# EAGLE design sr_controller_v1_revC (EAGLE 6.3)
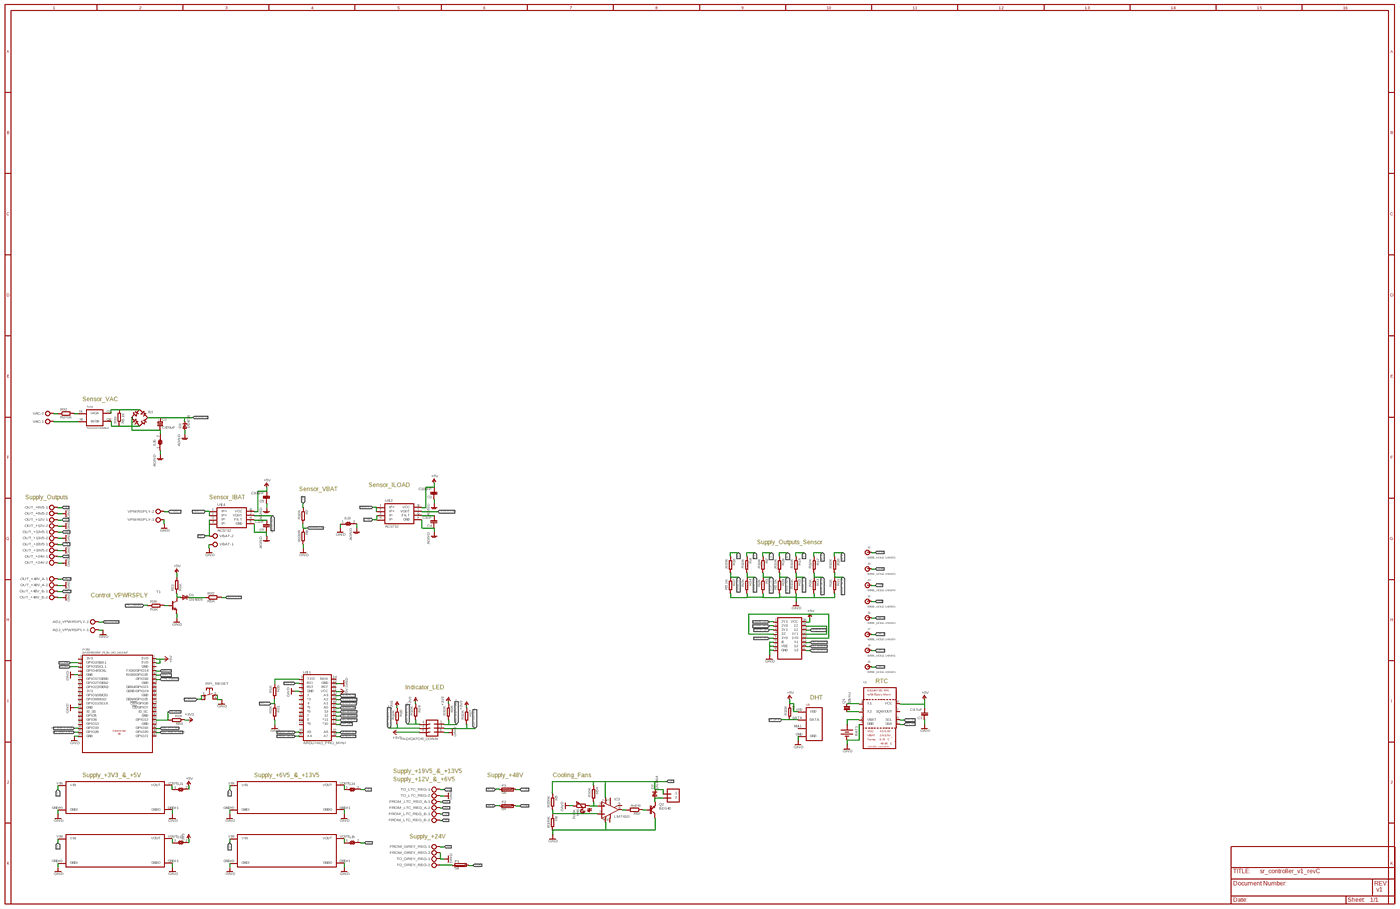
[diagram p0: schematic, sheet 1, overview]
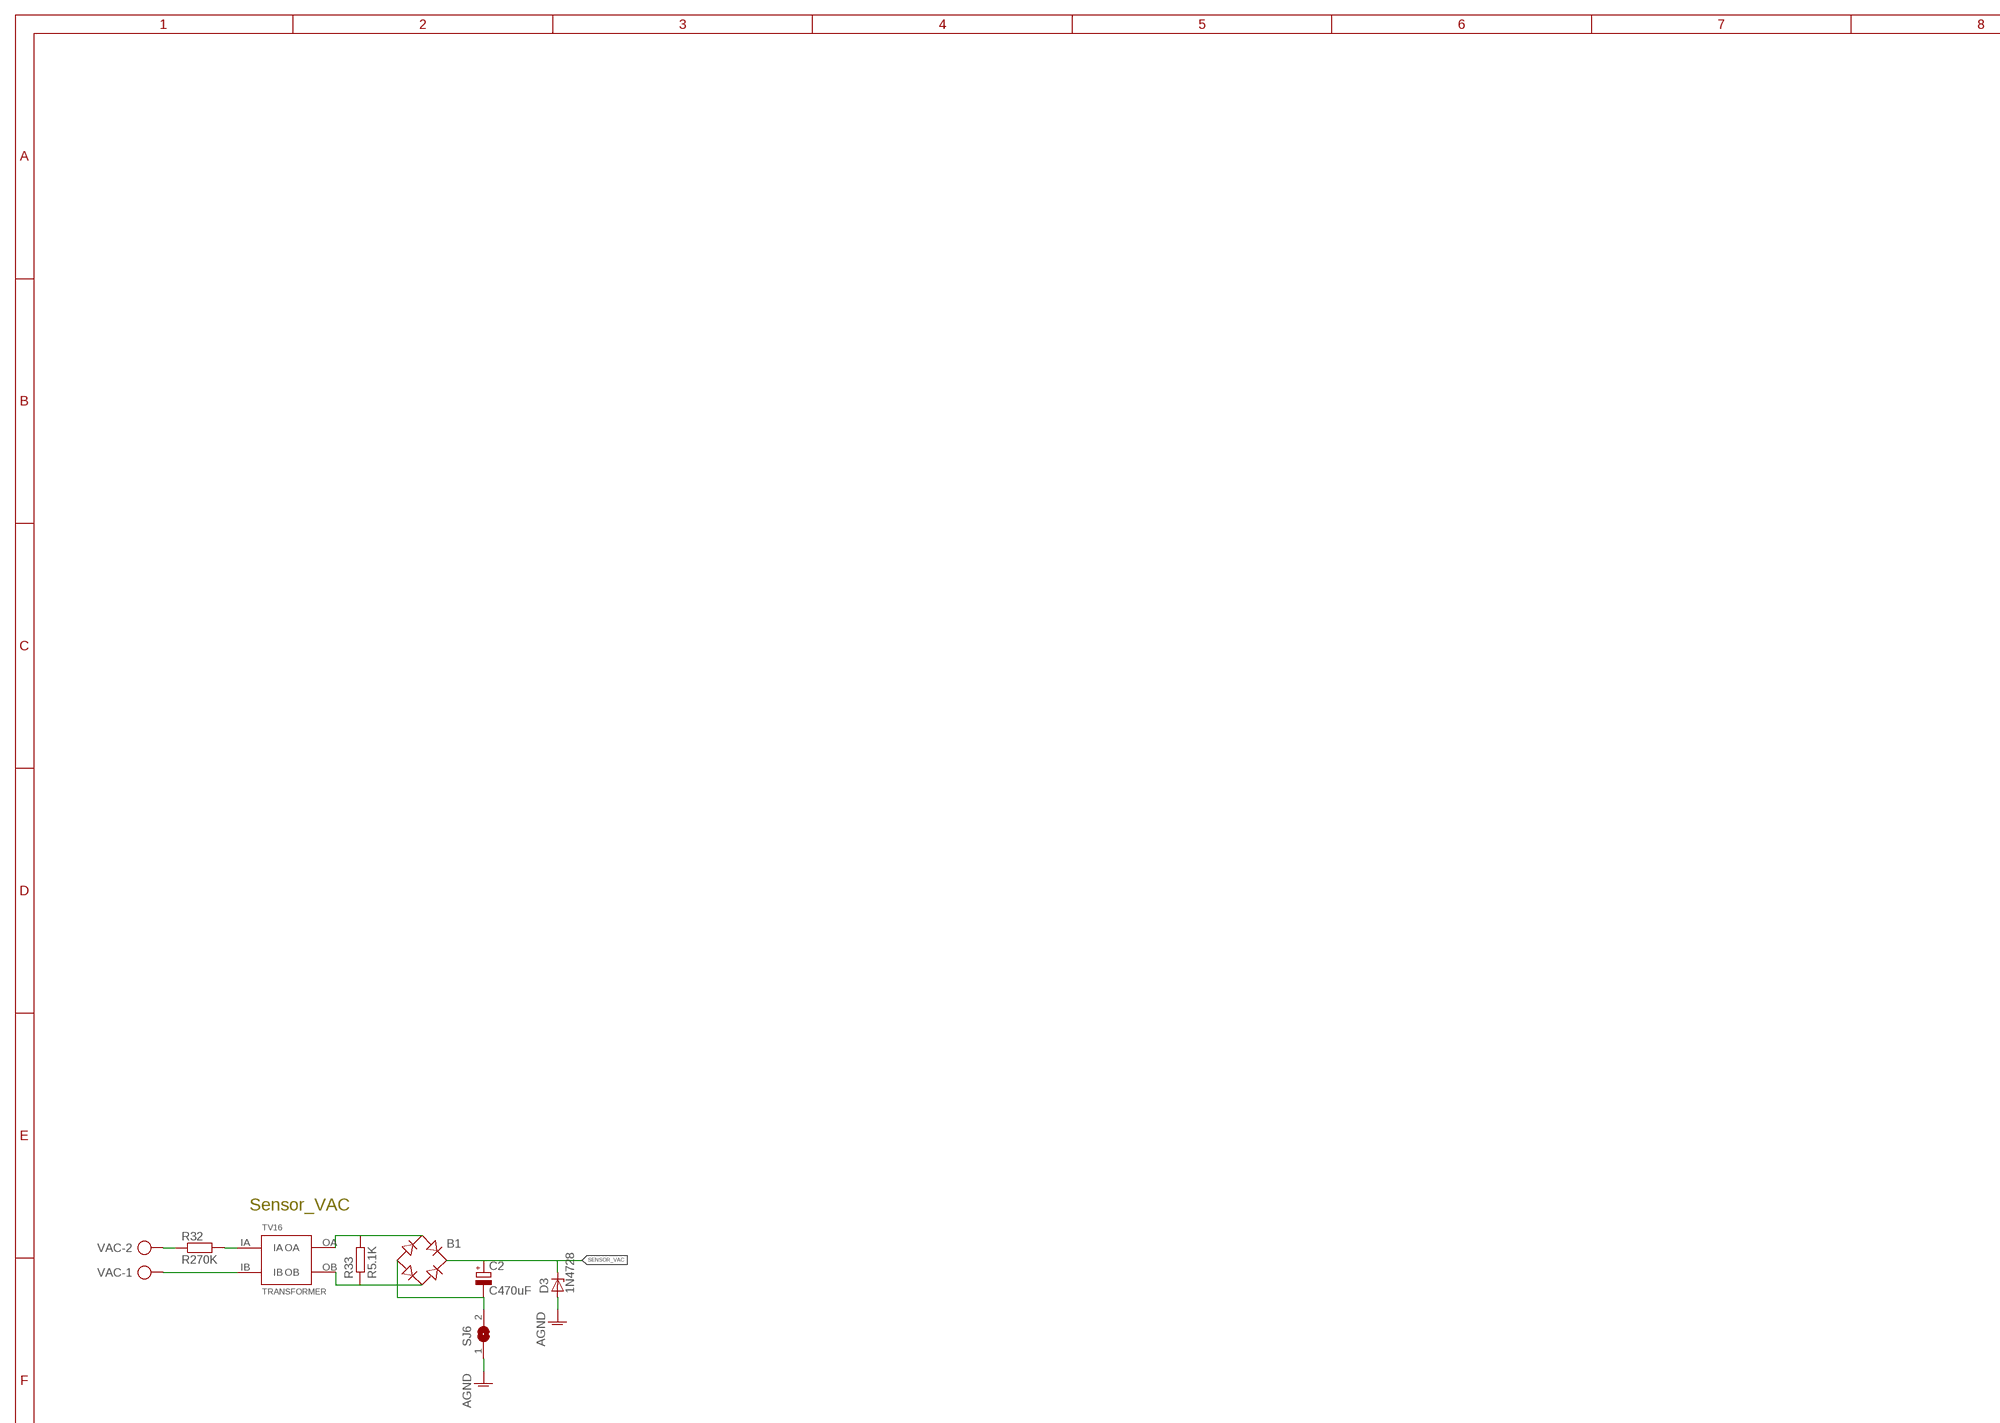
[diagram p1: schematic, sheet 1, part 1 of 4]
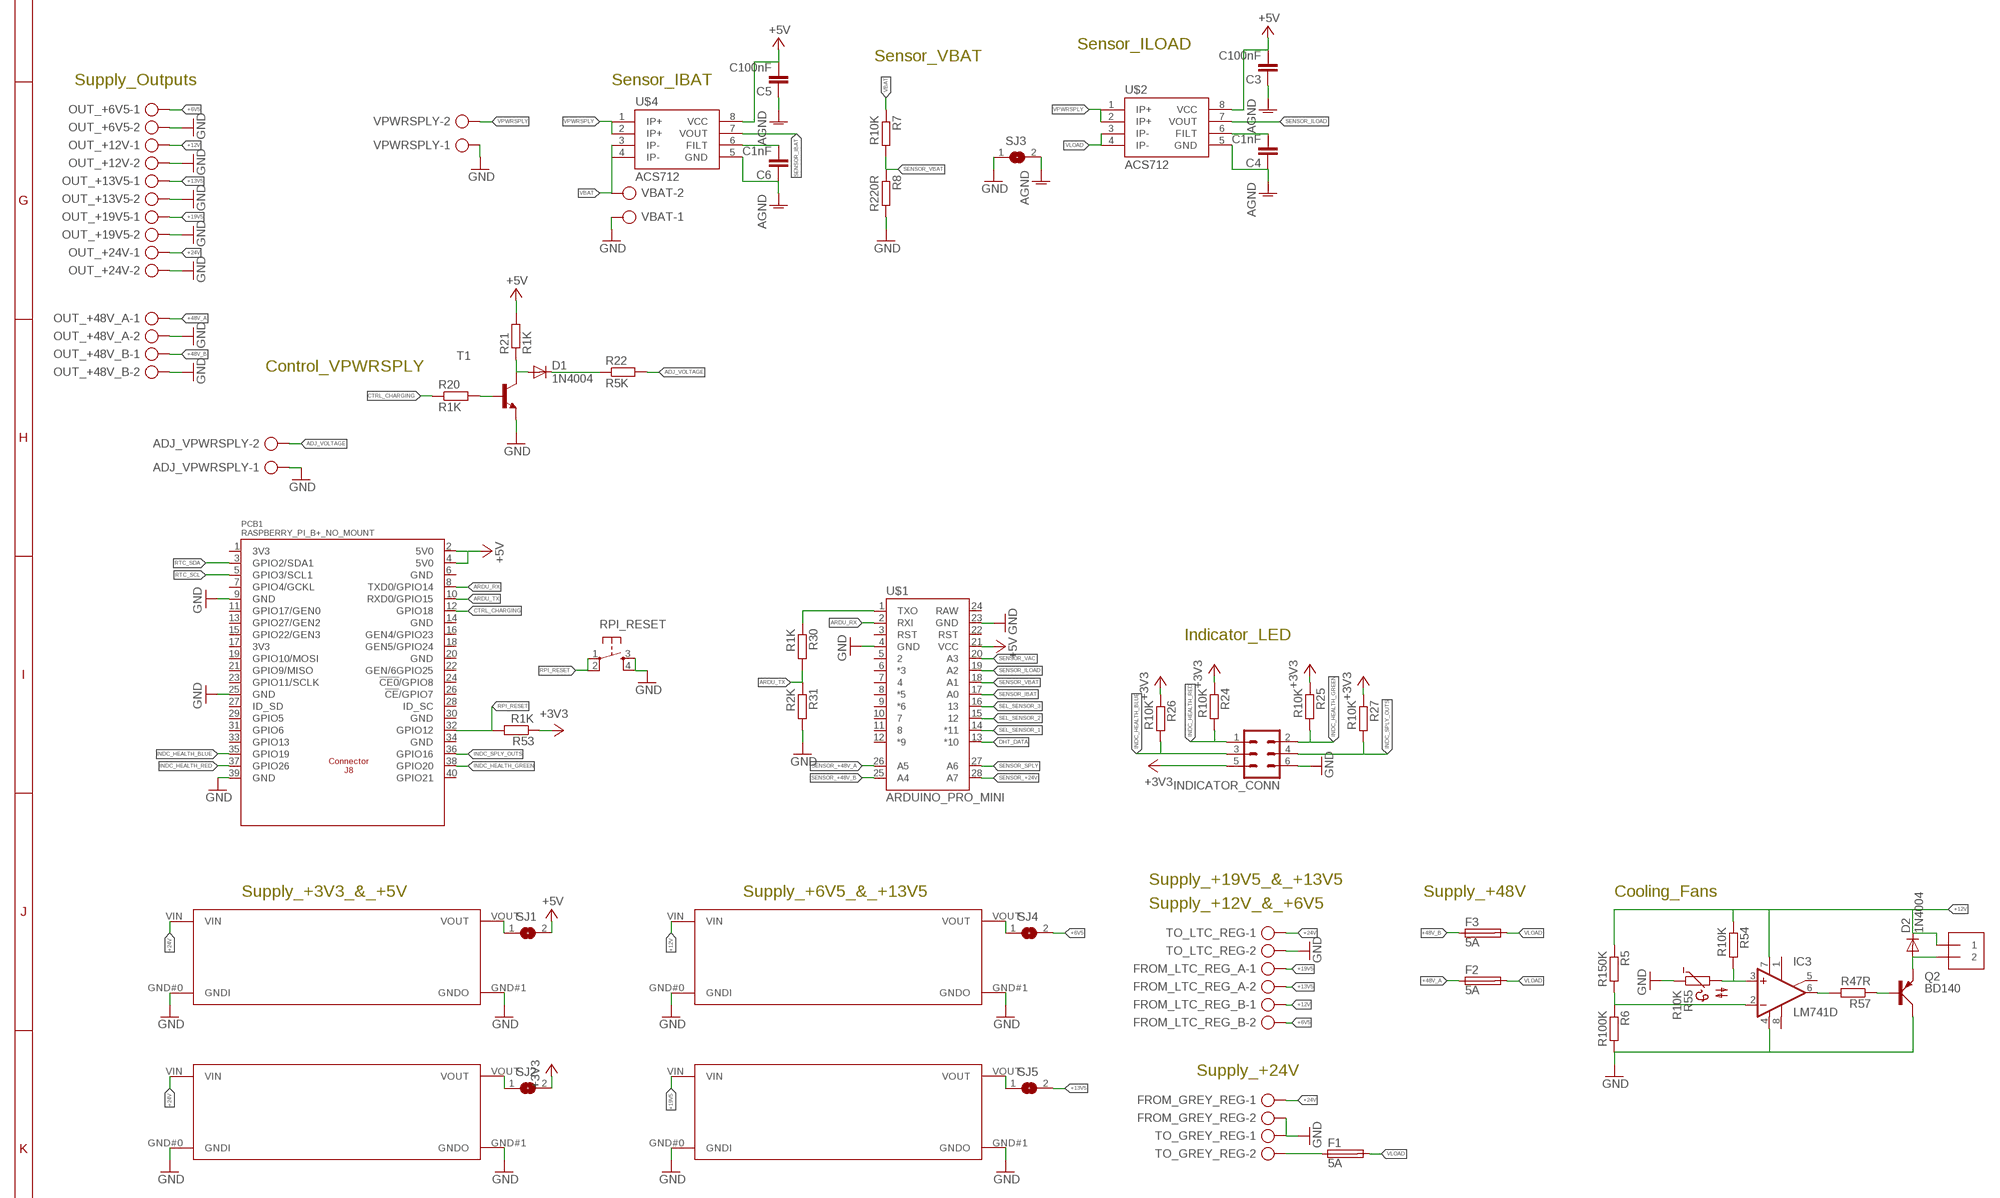
[diagram p2: schematic, sheet 1, part 2 of 4]
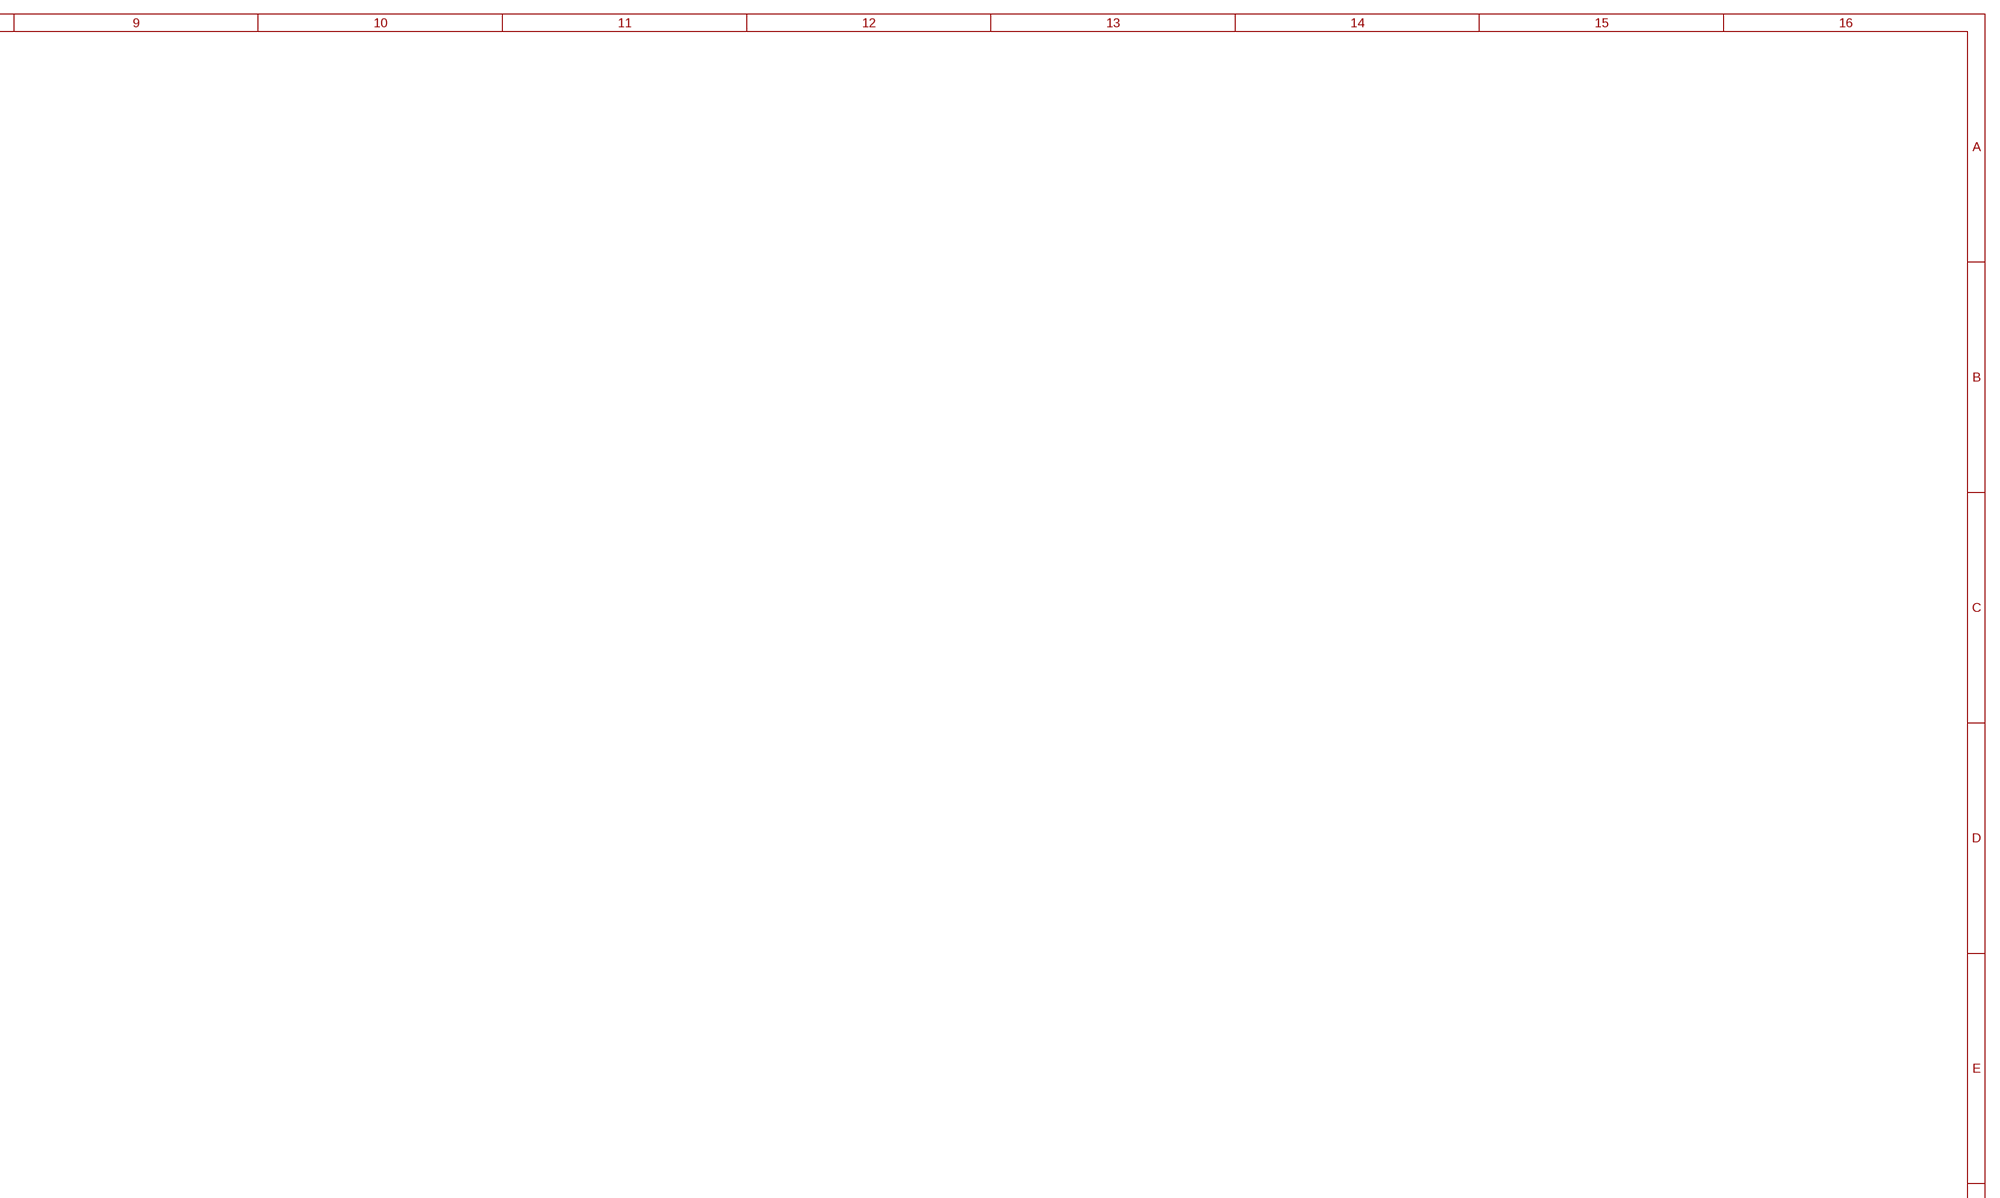
[diagram p3: schematic, sheet 1, part 3 of 4]
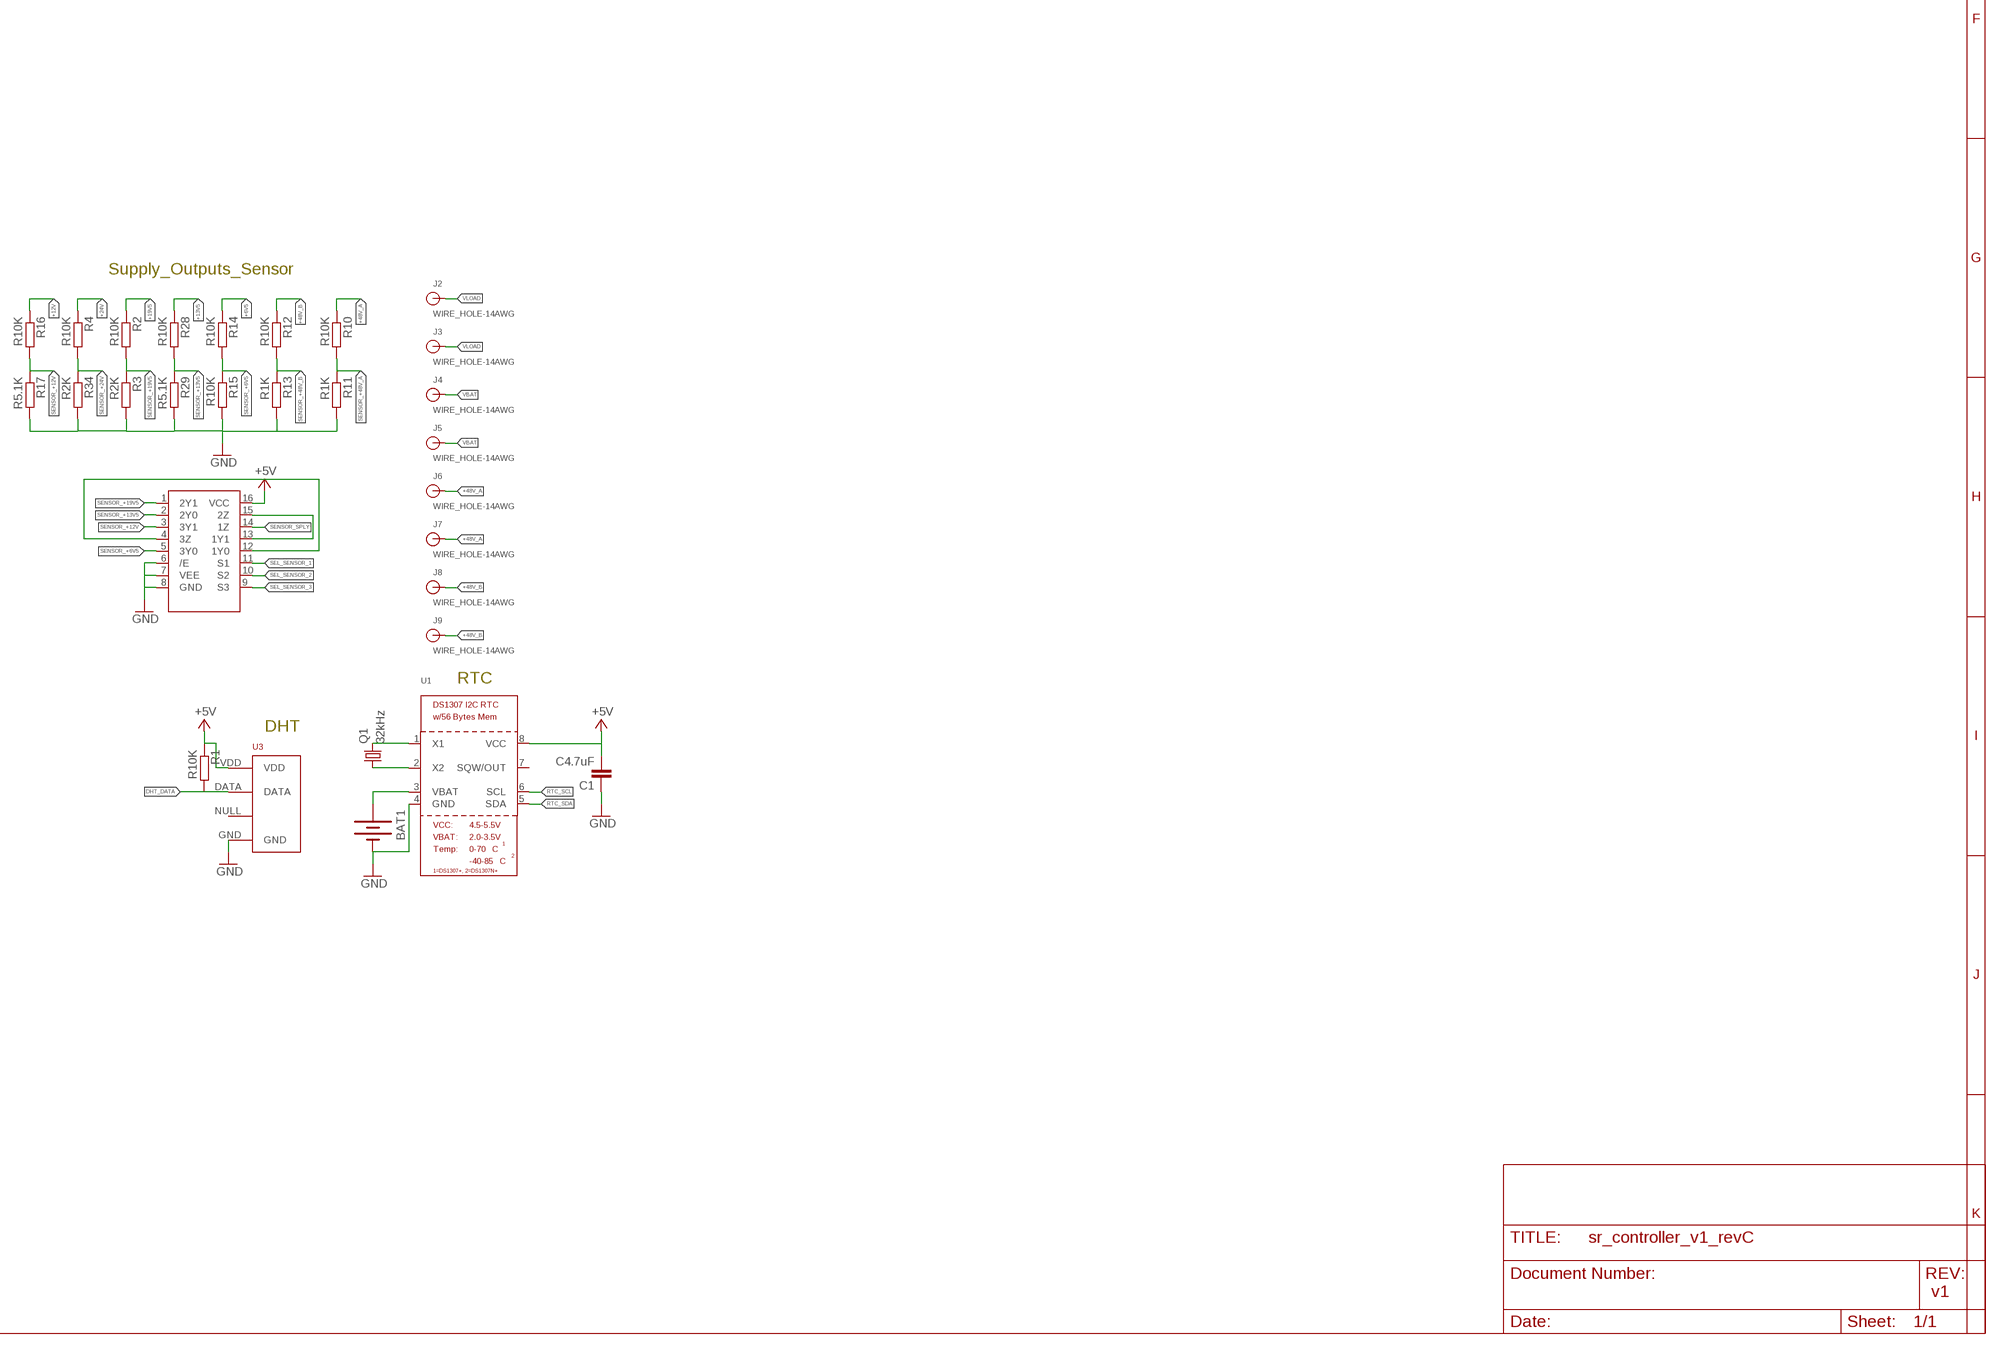
[diagram p4: schematic, sheet 1, part 4 of 4]

## Parts
ADJ_VPWRSPLY  AK300/2  [AK300/2]
B1  RB1A  [RB1A]
BAT1  BATTERY20PTH  [BATTCOM_20MM_PTH]
C1  C4.7uF  C-EUC0805  [C0805]
C2  C470uF  CPOL-EUE3.5-8  [E3,5-8]
C3  C100nF  C-EUC0805K  [C0805K]
C4  C1nF  C-EUC0805K  [C0805K]
C5  C100nF  C-EUC0805K  [C0805K]
C6  C1nF  C-EUC0805K  [C0805K]
D1  1N4004  [DO41-10]
D2  1N4004  [DO41-10]
D3  1N4728  [DO41Z10]
F1  5A  BLADE_FUSE_HOLDER  [BLADE_FUSE_HOLDER]
F2  5A  BLADE_FUSE_HOLDER  [BLADE_FUSE_HOLDER]
F3  5A  BLADE_FUSE_HOLDER  [BLADE_FUSE_HOLDER]
FAN_A  1X2-3.5MM  [1X2-3.5MM]
FROM_GREY_REG  AK300/2  [AK300/2]
FROM_LTC_REG_A  AK300/2  [AK300/2]
FROM_LTC_REG_B  AK300/2  [AK300/2]
IC3  LM741D  [SO08]
INDICATOR_CONN  MA03-2  [MA03-2]
J2  WIRE_HOLE-14AWG  [WIRE_HOLE-14AWG]
J3  WIRE_HOLE-14AWG  [WIRE_HOLE-14AWG]
J4  WIRE_HOLE-14AWG  [WIRE_HOLE-14AWG]
J5  WIRE_HOLE-14AWG  [WIRE_HOLE-14AWG]
J6  WIRE_HOLE-14AWG  [WIRE_HOLE-14AWG]
J7  WIRE_HOLE-14AWG  [WIRE_HOLE-14AWG]
J8  WIRE_HOLE-14AWG  [WIRE_HOLE-14AWG]
J9  WIRE_HOLE-14AWG  [WIRE_HOLE-14AWG]
OUT_+6V5  AK500/2  [AK500/2]
OUT_+12V  AK500/2  [AK500/2]
OUT_+13V5  AK500/2  [AK500/2]
OUT_+19V5  AK500/2  [AK500/2]
OUT_+24V  AK500/2  [AK500/2]
OUT_+48V_A  AK500/2  [AK500/2]
OUT_+48V_B  AK500/2  [AK500/2]
PCB1  RASPBERRY_PI_B+_NO_MOUNT  [RASPBERRY_PI_B+]
Q1  32kHz  CRYSTALTC38H  [TC38H]
Q2  BD140  [TO126AV]
R1  R10K  R-EU_R0805  [R0805]
R2  R10K  R-EU_R0805  [R0805]
R3  R2K  R-EU_R0805  [R0805]
R4  R10K  R-EU_R0805  [R0805]
R5  R150K  R-EU_R0805  [R0805]
R6  R100K  R-EU_R0805  [R0805]
R7  R10K  R-EU_R0805  [R0805]
R8  R220R  R-EU_R0805  [R0805]
R10  R10K  R-EU_R0805  [R0805]
R11  R1K  R-EU_R0805  [R0805]
R12  R10K  R-EU_R0805  [R0805]
R13  R1K  R-EU_R0805  [R0805]
R14  R10K  R-EU_R0805  [R0805]
R15  R10K  R-EU_R0805  [R0805]
R16  R10K  R-EU_R0805  [R0805]
R17  R5.1K  R-EU_R0805  [R0805]
R20  R1K  R-EU_R0805  [R0805]
R21  R1K  R-EU_R0805  [R0805]
R22  R5K  R-EU_R0805  [R0805]
R24  R10K  R-EU_R0805  [R0805]
R25  R10K  R-EU_R0805  [R0805]
R26  R10K  R-EU_R0805  [R0805]
R27  R10K  R-EU_R0805  [R0805]
R28  R10K  R-EU_R0805  [R0805]
R29  R5.1K  R-EU_R0805  [R0805]
R30  R1K  R-EU_R0805  [R0805]
R31  R2K  R-EU_R0805  [R0805]
R32  R270K  R-EU_0309/10  [0309/10]
R33  R5.1K  R-EU_0309/10  [0309/10]
R34  R2K  R-EU_R0805  [R0805]
R53  R1K  R-EU_R0805  [R0805]
R54  R10K  R-EU_R0805  [R0805]
R55  R10K  NTC642-6  [P642]
R57  R47R  R-EU_R0805  [R0805]
RPI_RESET  TAC_SWITCHPTH  [TACTILE-PTH]
SJ1  SOLDERJUMPER  [SOLDERJUMPER_ARROW_NOPASTE]
SJ2  SOLDERJUMPER  [SOLDERJUMPER_ARROW_NOPASTE]
SJ3  SOLDERJUMPERCLOSED  [SOLDERJUMPER_CLOSEDWIRE]
SJ4  SOLDERJUMPER  [SOLDERJUMPER_ARROW_NOPASTE]
SJ5  SOLDERJUMPER  [SOLDERJUMPER_ARROW_NOPASTE]
SJ6  SOLDERJUMPERREFLOW  [SOLDERJUMPER_REFLOW]
T1  MMBT2222ALT1-NPN-SOT23-BEC  [SOT23-BEC]
TO_GREY_REG  AK300/2  [AK300/2]
TO_LTC_REG  AK300/2  [AK300/2]
TV16  TRANSFORMER  [TV16]
U1  RTC_DS1307  [SOIC8_150MIL]
U3  RHT03_DHT-22_AM2302  [RHT03_DHT-22]
U$1  ARDUINO_PRO_MINI  [ARDUINO_PRO_MINI]
U$2  ACS712  [SO08]
U$3  DCDCMODULE  [DCDCMODULE]
U$4  ACS712  [SO08]
U$5  DCDCMODULE  [DCDCMODULE]
U$6  DCDCMODULE  [DCDCMODULE]
U$8  74HC4053D  [SO16]
U$10  DCDCMODULE  [DCDCMODULE]
VAC  AK300/2  [AK300/2]
VBAT  AK300/2  [AK300/2]
VPWRSPLY  AK300/2  [AK300/2]

## Nets
+3V3: INDICATOR_CONN.5 R24.1 R25.1 R26.1 R27.1 R53.1 SJ2.2
+5V: C1.2 C3.2 C5.2 PCB1.2(5V0) PCB1.4(5V0) R1.1 R21.2 SJ1.2 U1.8(VCC) U3.VDD U$1.21(VCC) U$2.8(VCC) U$4.8(VCC) U$8.16(VCC)
+6V5: FROM_LTC_REG_B.2 OUT_+6V5.1 R14.1 SJ4.2
+12V: D2.C FAN_A.1 FROM_LTC_REG_B.1 IC3.7(V+) OUT_+12V.1 R5.1 R16.1 R54.1 U$5.VIN
+13V5: FROM_LTC_REG_A.2 OUT_+13V5.1 R28.1 SJ5.2
+19V5: FROM_LTC_REG_A.1 OUT_+19V5.1 R2.1 U$10.VIN
+24V: FROM_GREY_REG.1 OUT_+24V.1 R4.1 TO_LTC_REG.1 U$3.VIN U$6.VIN
+48V_A: F2.1 J6.P$1 J7.P$1 OUT_+48V_A.1 R10.1
+48V_B: F3.1 J8.P$1 J9.P$1 OUT_+48V_B.1 R12.1
ADJ_VOLTAGE: ADJ_VPWRSPLY.2 R22.2
AGND: C3.1 C4.1 C5.1 C6.1 D3.A SJ3.2 SJ6.1 U$2.5(GND) U$4.5(GND)
ARDU_RX: PCB1.8(TXD0/GPIO14) U$1.2(RXI)
ARDU_TX: PCB1.10(RXD0/GPIO15) R30.2 R31.1
CTRL_CHARGING: PCB1.12(GPIO18) R20.1
DHT_DATA: R1.2 U3.DATA U$1.13(*10)
GND: ADJ_VPWRSPLY.1 BAT1.2(-) C1.1 FROM_GREY_REG.2 IC3.4(V-) INDICATOR_CONN.6 OUT_+6V5.2 OUT_+12V.2 OUT_+13V5.2 OUT_+19V5.2 OUT_+24V.2 OUT_+48V_A.2 OUT_+48V_B.2 PCB1.9(GND) PCB1.25(GND) PCB1.39(GND) Q2.C R3.2 R6.2 R8.2 R11.2 R13.2 R15.2 R17.2 R29.2 R31.2 R34.2 R55.1 RPI_RESET.3 RPI_RESET.4 SJ3.1 T1.E TO_GREY_REG.1 TO_LTC_REG.2 U1.4(GND) U3.GND U$1.4(GND) U$1.23(GND) U$3.GND#0(GNDI) U$3.GND#1(GNDO) U$5.GND#0(GNDI) U$5.GND#1(GNDO) U$6.GND#0(GNDI) U$6.GND#1(GNDO) U$8.6(/E) U$8.7(VEE) U$8.8(GND) U$10.GND#0(GNDI) U$10.GND#1(GNDO) VBAT.1 VPWRSPLY.1
INDC_HEALTH_BLUE: INDICATOR_CONN.3 PCB1.35(GPIO19) R26.2
INDC_HEALTH_GREEN: INDICATOR_CONN.2 PCB1.38(GPIO20) R25.2
INDC_HEALTH_RED: INDICATOR_CONN.1 PCB1.37(GPIO26) R24.2
INDC_SPLY_OUTS: INDICATOR_CONN.4 PCB1.36(GPIO16) R27.2
N$1: R32.1 VAC.2
N$2: TV16.IB VAC.1
N$3: Q1.2 U1.1(X1)
N$4: Q1.1 U1.2(X2)
N$5: BAT1.1(+) U1.3(VBAT)
N$6: U$8.13(1Y1) U$8.15(2Z)
N$7: U$8.4(3Z) U$8.12(1Y0)
N$8: SJ1.1 U$3.VOUT
N$9: SJ2.1 U$6.VOUT
N$10: C4.2 U$2.6(FILT)
N$13: SJ4.1 U$5.VOUT
N$15: IC3.3(+IN) R54.2 R55.2
N$16: C6.2 U$4.6(FILT)
N$17: F1.1 TO_GREY_REG.2
N$18: IC3.2(-IN) R5.2 R6.1
N$19: D1.A R21.1 T1.C
N$20: D2.A FAN_A.2 Q2.E
N$21: B1.AC1 R33.2 TV16.OA
N$22: R20.2 T1.B
N$23: SJ5.1 U$10.VOUT
N$24: D1.C R22.1
N$26: B1.- C2.- SJ6.2
N$35: R30.1 U$1.1(TXO)
N$36: R32.2 TV16.IA
N$38: B1.AC2 R33.1 TV16.OB
N$39: IC3.6(OUT) R57.2
N$40: Q2.B R57.1
RPI_RESET: PCB1.32(GPIO12) R53.2 RPI_RESET.1 RPI_RESET.2
RTC_SCL: PCB1.5(GPIO3/SCL1) U1.6(SCL)
RTC_SDA: PCB1.3(GPIO2/SDA1) U1.5(SDA)
SEL_SENSOR_1: U$1.14(*11) U$8.11(S1)
SEL_SENSOR_2: U$1.15 U$8.10(S2)
SEL_SENSOR_3: U$1.16 U$8.9(S3)
SENSOR_+6V5: R14.2 R15.1 U$8.5(3Y0)
SENSOR_+12V: R16.2 R17.1 U$8.3(3Y1)
SENSOR_+13V5: R28.2 R29.1 U$8.2(2Y0)
SENSOR_+19V5: R2.2 R3.1 U$8.1(2Y1)
SENSOR_+24V: R4.2 R34.1 U$1.28(A7)
SENSOR_+48V_A: R10.2 R11.1 U$1.26(A5)
SENSOR_+48V_B: R12.2 R13.1 U$1.25(A4)
SENSOR_IBAT: U$1.17(A0) U$4.7(VOUT)
SENSOR_ILOAD: U$1.19(A2) U$2.7(VOUT)
SENSOR_SPLY: U$1.27(A6) U$8.14(1Z)
SENSOR_VAC: B1.+ C2.+ D3.C U$1.20(A3)
SENSOR_VBAT: R7.2 R8.1 U$1.18(A1)
VBAT: J4.P$1 J5.P$1 R7.1 U$4.3(IP-) U$4.4(IP-) VBAT.2
VLOAD: F1.2 F2.2 F3.2 J2.P$1 J3.P$1 U$2.3(IP-) U$2.4(IP-)
VPWRSPLY: U$2.1(IP+) U$2.2(IP+) U$4.1(IP+) U$4.2(IP+) VPWRSPLY.2
Unconnected: IC3.1(ON1) IC3.5(ON2) IC3.8(OPT) PCB1.1(3V3) PCB1.6(GND) PCB1.7(GPIO4/GCKL) PCB1.11(GPIO17/GEN0) PCB1.13(GPIO27/GEN2) PCB1.14(GND) PCB1.15(GPIO22/GEN3) PCB1.16(GEN4/GPIO23) PCB1.17(3V3) PCB1.18(GEN5/GPIO24) PCB1.19(GPIO10/MOSI) PCB1.20(GND) PCB1.21(GPIO9/MISO) PCB1.22(GEN/6GPIO25) PCB1.23(GPIO11/SCLK) PCB1.24(!CE0!/GPIO8) PCB1.26(!CE!/GPIO7) PCB1.27(ID_SD) PCB1.28(ID_SC) PCB1.29(GPIO5) PCB1.30(GND) PCB1.31(GPIO6) PCB1.33(GPIO13) PCB1.34(GND) PCB1.40(GPIO21) U1.7(SQW/OUT) U3.NULL U$1.3(RST) U$1.5 U$1.6(*3) U$1.7 U$1.8(*5) U$1.9(*6) U$1.10 U$1.11 U$1.12(*9) U$1.22(RST) U$1.24(RAW)

## Notes on the sheet
- Sensor_VAC
- Sensor_ILOAD
- Sensor_VBAT
- Supply_Outputs | Sensor_IBAT
- Supply_Outputs_Sensor
- Control_VPWRSPLY
- RTC
- Indicator_LED
- DHT
- Supply_+19V5_&_+13V5
- Supply_+3V3_&_+5V | Supply_+6V5_&_+13V5 | Supply_+48V | Cooling_Fans
- Supply_+12V_&_+6V5
- Supply_+24V
- v1

## Library data of the parts
ADJ_VPWRSPLY FROM_GREY_REG FROM_LTC_REG_A FROM_LTC_REG_B TO_GREY_REG TO_LTC_REG VAC VBAT VPWRSPLY = con-ptr500:AK300/2: CONNECTOR; OC_FARNELL: unknown; OC_NEWARK: unknown
B1 = rectifier:RB1A: RECTIFIER 1 A
BAT1 = SparkFun-Electromechanical:BATTERY: Battery Holders Various common sizes : AA, AAA, 20mm coin cell and 12mm coin cell. 20MM_4LEGS, BATT-10373
C1 C3-C6 = resistor:C-EU: CAPACITOR, European symbol
C2 = resistor:CPOL-EU: POLARIZED CAPACITOR, European symbol
D1 D2 = diode:1N4004: DIODE general purpose rectifier, 1 A
D3 = diode:1N4728: Z DIODE 3.3 V, 1W, 5 percent
F1-F3 = tigorcustom:BLADE_FUSE_HOLDER: FUSE HOLDER CS PFP30, Schukat; OC_FARNELL: unknown; OC_NEWARK: unknown
FAN_A = adafruit:1X2: 3.5mm Terminal block http://www.ladyada.net/library/pcb/eaglelibrary.html
IC3 = linear:*741: OP AMP
INDICATOR_CONN = con-lstb:MA03-2: PIN HEADER; OC_FARNELL: unknown; OC_NEWARK: unknown
J2-J9 = powercube:WIRE_HOLE-14AWG: Solder point for 14AWG wire
OUT_+6V5 OUT_+12V OUT_+13V5 OUT_+19V5 OUT_+24V OUT_+48V_A OUT_+48V_B = con-ptr500:AK500/2: CONNECTOR; OC_FARNELL: unknown; OC_NEWARK: unknown
PCB1 = tigorcustom:RASPBERRY_PI_B+_NO_MOUNT: Raspberry Pi B+ Based on issue: Thursday, July 10, 2014 - Rev 1.2 LBR by Tim R. 07-2014
Q1 = crystal:CRYSTAL: CRYSTAL; OC_FARNELL: unknown; OC_NEWARK: unknown
Q2 = transistor-power:BD140: PNP TRANSISTOR
R1-R8 R10-R17 R20-R22 R24-R34 R53 R54 R57 = resistor:R-EU_: RESISTOR, European symbol
R55 = ptc-ntc:NTC642-6: PHILIPS NTC; OC_FARNELL: unknown; OC_NEWARK: unknown
RPI_RESET = SparkFun-Electromechanical:TAC_SWITCH: Momentary Switch Button commonly used for reset or general input. Spark Fun Electronics SKU : COM-00097 SMT- SWCH-08247
SJ1 SJ2 SJ4 SJ5 = microbuilder:SOLDERJUMPER: SMD Solder JUMPER Solder the two pads together to create a connection, or remove the solder to break it. REFLOW - Use this footprint for solder paste and reflow ovens. WAVE - Use this footprint for hand-soldering (larger pads). CLOSED - Has a trace between the two pads to ensure it is closed by default. The trace needs to be cut to disable the jumper, and can be closed again by creating a solder bridge between the two pads.; BOM: EXCLUDE
SJ3 SJ6 = microbuilder:SOLDERJUMPER: SMD Solder JUMPER Solder the two pads together to create a connection, or remove the solder to break it. REFLOW - Use this footprint for solder paste and reflow ovens. WAVE - Use this footprint for hand-soldering (larger pads). CLOSED - Has a trace between the two pads to ensure it is closed by default. The trace needs to be cut to disable the jumper, and can be closed again by creating a solder bridge between the two pads.
T1 = transistor:*-NPN-: NPN Transistror BF959 corrected 2008.03.06
TV16 = bontor:TRANSFORMER
U1 = microbuilder:RTC_DS1307: DS1307 I2C RTC with 56-Bytes RAM
U3 = RHT03_DHT-22_AM2302:RHT03_DHT-22_AM2302: RHT03 / DHT-22 / AM2302 Packages and symbol for the RHT03 / DHT-22 relative humidity and temperature sensor. Note: The AM2302 is a wired version of the DHT-22 which typically requires less clearance and is thus provided as a separate package.; PROD_ID: SEN-10167
U$1 = tigorcustom:ARDUINO_PRO_MINI
U$2 U$4 = SparkFun-AnalogIC:ACS712: Hall-effect-based isolated linear current sensor
U$3 U$5 U$6 U$10 = bontor:DCDCMODULE
U$8 = tigorcustom:74HC4053D

## Board
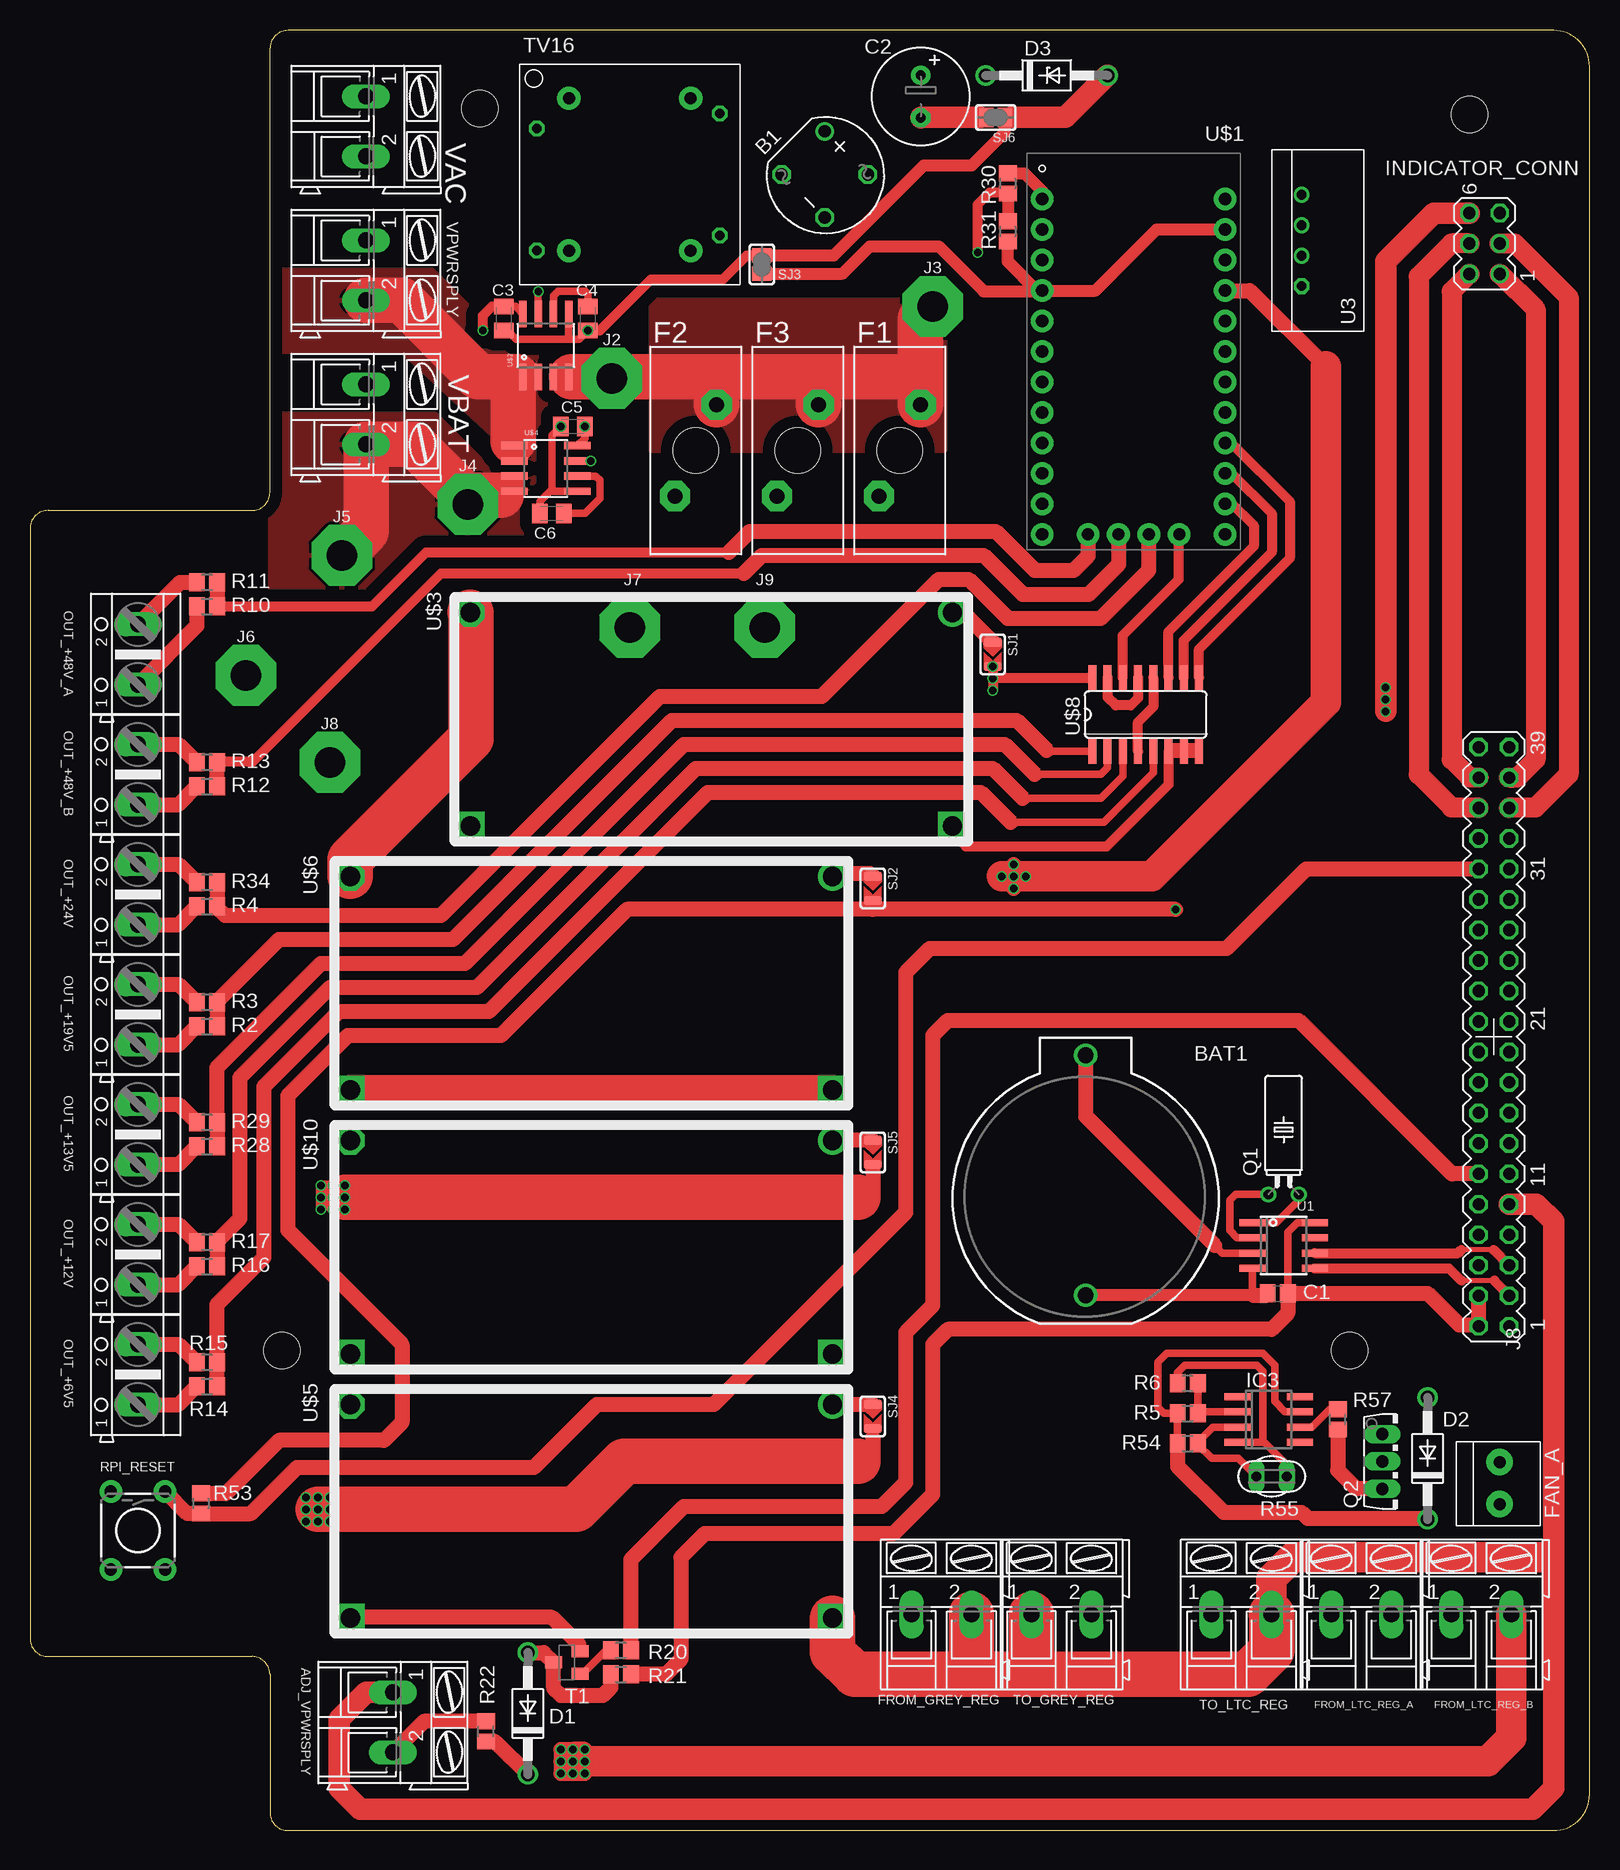
[diagram p5: board, top side]
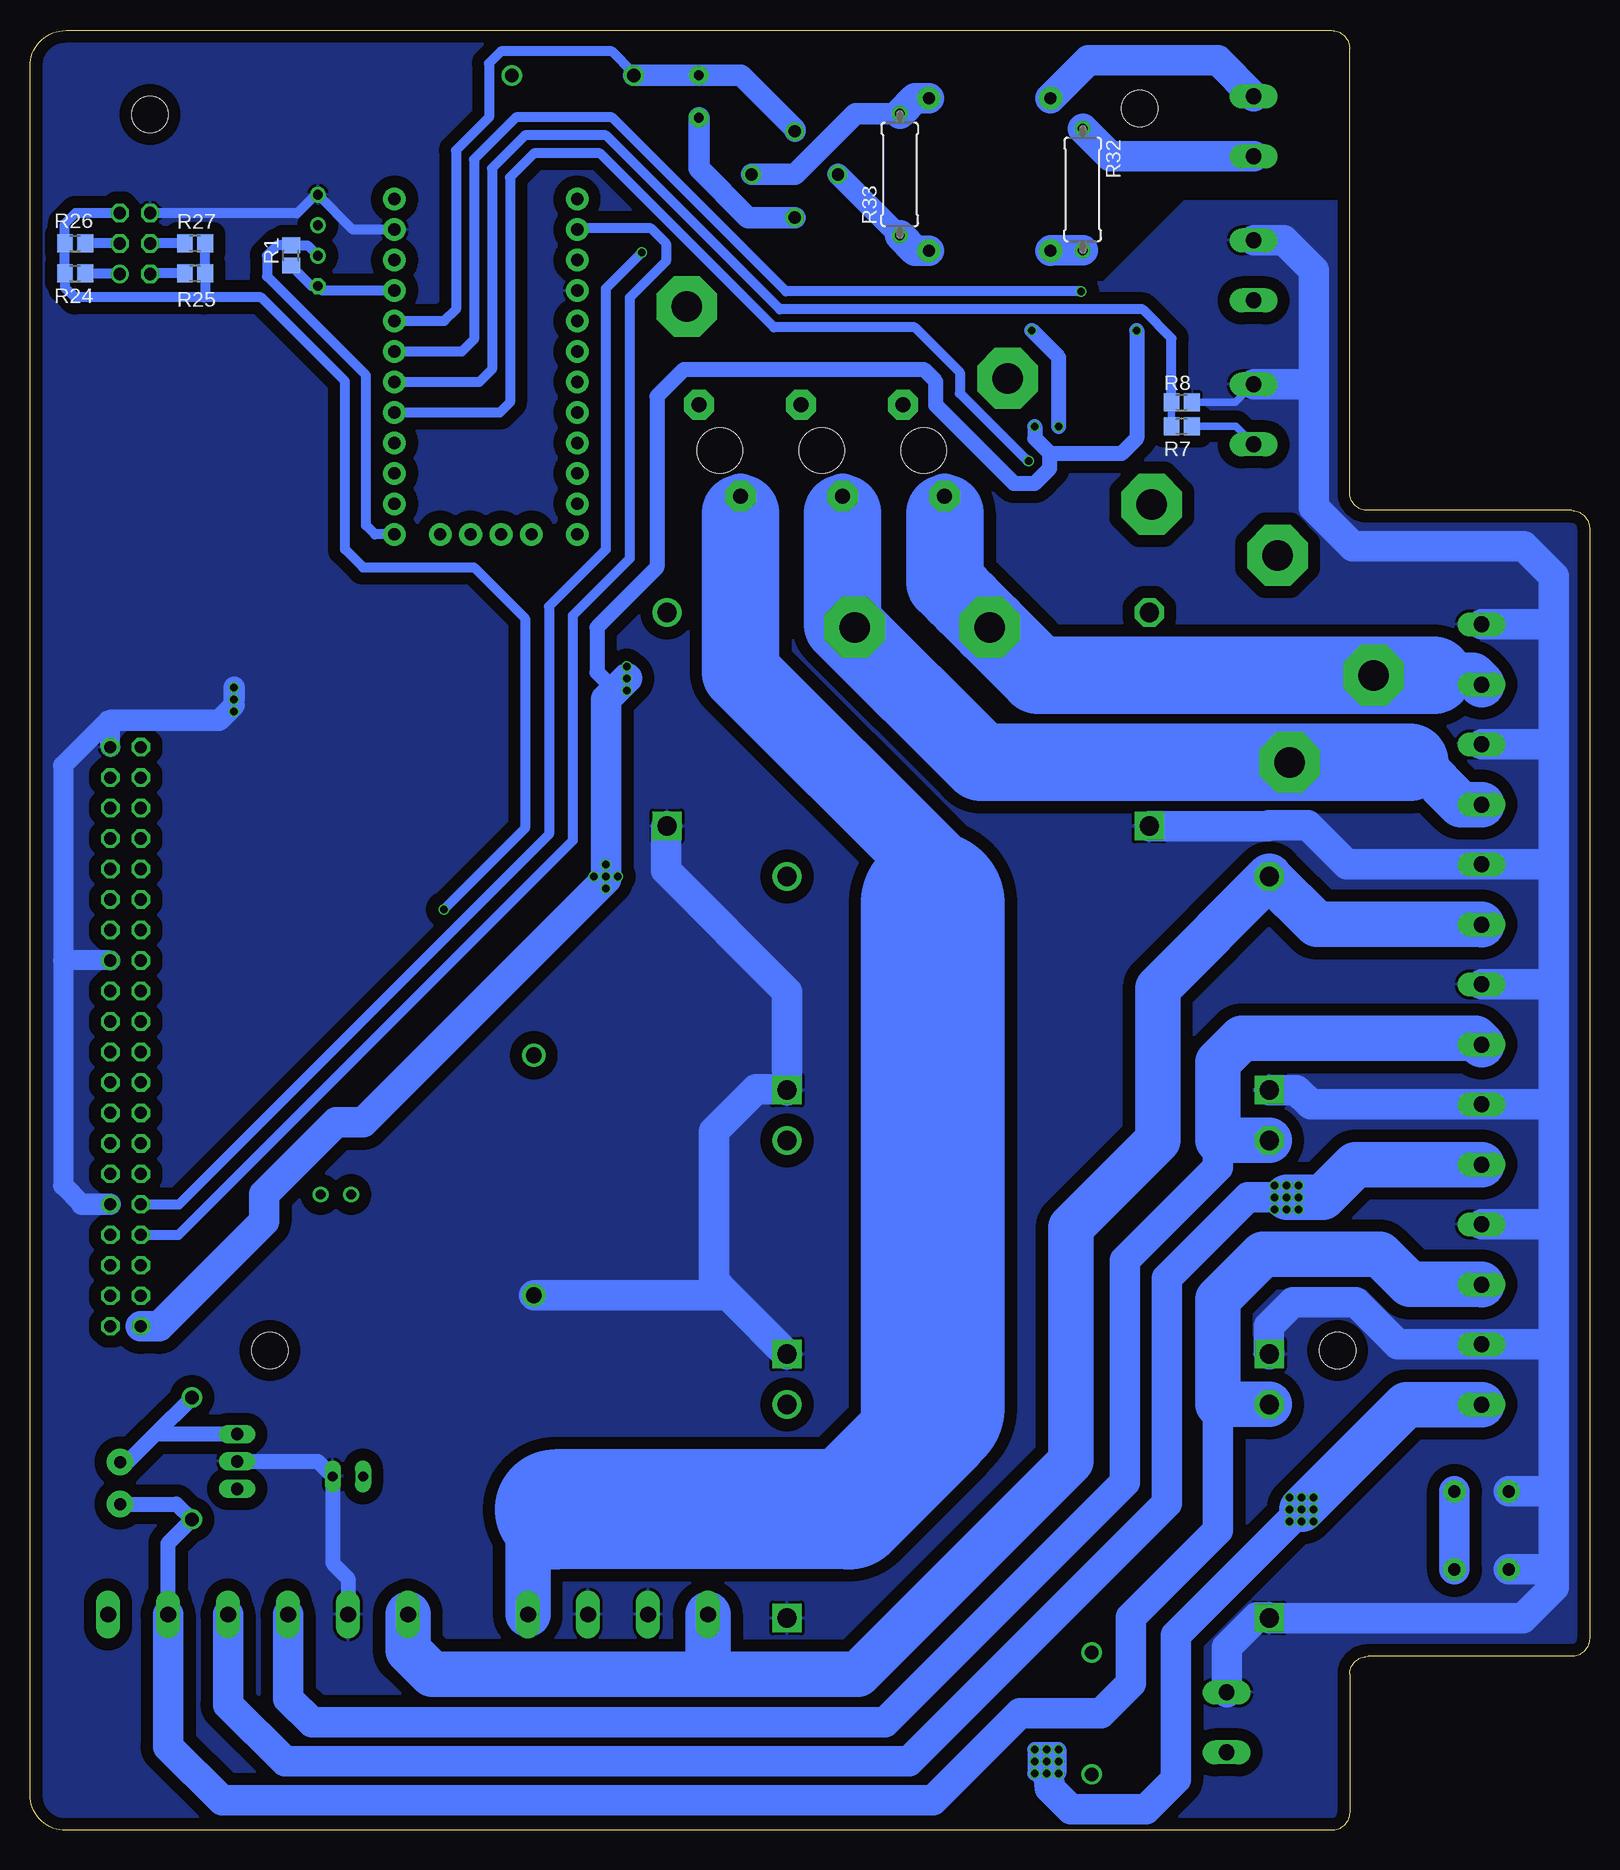
[diagram p6: board, bottom side, seen from below]

Size 130 x 150 mm. Coordinates in mm from the lower left corner, seen from the top.
Outline: 21.5,0 127,0 arc90 130,3 130,147 arc90 127,150 21.5,150 arc90 20,148.5 20,111.5 arc-90 18.5,110 1.5,110 arc90 0,108.5 0,16 arc90 1.5,14.5 18.5,14.5 arc-90 20,13 20,1.5 arc90 21.5,0
Copper layers (1*16): Top 0.035mm / dielectric 1.5mm / Bottom 0.035mm
Design rules "ITEADstudio_DRC": minimum track width 6mil, minimum drill 12mil, track to track 6mil, track to pad 6mil, pad to pad 6mil, via to via 6mil, smd to smd 0mil, copper to edge 10mil, drill to drill 10mil, minimum pad ring 10mil, minimum via ring 6mil, stop-mask expansion 2mil, vias tented up to drill 100mil, thermal gap 10mil
Holes 3 mm at 21,40 37.5,143.5 120,143 110,40

### Footprints (pad centres in the part's own frame; a part is rotated, then mirrored left to right if it is on the bottom)
AK300/2 = drill 1.321 long: 1 -2.515,0; 2 2.489,0
RB1A = drill 1.016: + -2.54,2.54 | drill 1.016 octagon: - 2.54,-2.54; AC1 2.54,2.54; AC2 -2.54,-2.54
BATTCOM_20MM_PTH = drill 1.3: 1 11.85,0; 2 -8.15,0
C0805 = smd 1.3 x 1.5: 1 -0.85,0; 2 0.85,0
E3,5-8 = drill 0.813 pad 1.6: + -1.778,0 | drill 0.813 pad 1.6 octagon: - 1.778,0
C0805K = smd 1.3 x 1.6: 1 -1,0; 2 1,0
DO41-10 = drill 1.118: A 5.08,0; C -5.08,0
DO41Z10 = drill 1.118: A 5.08,0; C -5.08,0
BLADE_FUSE_HOLDER = drill 1.27 pad 2.54 octagon: 1 1.73,3.81; 2 -1.73,-3.81 | hole 3.78: 0,0
1X2-3.5MM = drill 1 pad 2.184: 1 1.8,0; 2 -1.7,0
SO08 = smd 0.6 x 2.2: 1 -1.905,-2.6; 2 -0.635,-2.6; 3 0.635,-2.6; 4 1.905,-2.6; 5 1.905,2.6; 6 0.635,2.6; 7 -0.635,2.6; 8 -1.905,2.6
MA03-2 = drill 1.016: 1 -2.54,-1.27 | drill 1.016 octagon: 2 -2.54,1.27; 3 0,-1.27; 4 0,1.27; 5 2.54,-1.27; 6 2.54,1.27
WIRE_HOLE-14AWG = drill 2.54 pad 5.08 octagon: P$1 0,0
AK500/2 = drill 1.321 long: 1 -2.515,0; 2 2.515,0
RASPBERRY_PI_B+ = drill 1.016 octagon: 1 2.02,1.7; 2 2.02,4.24; 3 4.56,1.7; 4 4.56,4.24; 5 7.1,1.7; 6 7.1,4.24; 7 9.64,1.7; 8 9.64,4.24; 9 12.18,1.7; 10 12.18,4.24; 11 14.72,1.7; 12 14.72,4.24; 13 17.26,1.7; 14 17.26,4.24; 15 19.8,1.7; 16 19.8,4.24; 17 22.34,1.7; 18 22.34,4.24; 19 24.88,1.7; 20 24.88,4.24; 21 27.42,1.7; 22 27.42,4.24; 23 29.96,1.7; 24 29.96,4.24; 25 32.5,1.7; 26 32.5,4.24; 27 35.04,1.7; 28 35.04,4.24; 29 37.58,1.7; 30 37.58,4.24; 31 40.12,1.7; 32 40.12,4.24; 33 42.66,1.7; 34 42.66,4.24; 35 45.2,1.7; 36 45.2,4.24; 37 47.74,1.7; 38 47.74,4.24; 39 50.28,1.7; 40 50.28,4.24
TC38H = drill 0.813: 1 -1.27,0; 2 1.27,0
TO126AV = drill 1.016 long: B 2.286,-1.27; C 0,-1.27; E -2.286,-1.27
R0805 = smd 1.3 x 1.5: 1 -0.85,0; 2 0.85,0
0309/10 = drill 0.813 octagon: 1 -5.08,0; 2 5.08,0
P642 = drill 0.813 long: 1 -1.27,0; 2 1.27,0
TACTILE-PTH = drill 1.016 pad 1.88: 1 -3.251,2.261; 2 3.251,2.261; 3 -3.251,-2.261; 4 3.251,-2.261
SOLDERJUMPER_ARROW_NOPASTE = smd 0.762 x 1.524: 1 -1.016,0; 2 1.016,0
SOLDERJUMPER_CLOSEDWIRE = smd 1.168 x 1.6: 1 -0.762,0; 2 0.762,0 | smd 0.635 x 0.203: WIRE 0,0
SOLDERJUMPER_REFLOW = smd 1.168 x 1.6: 1 -0.762,0; 2 0.762,0
SOT23-BEC = smd 1 x 1.4: B -0.95,-1.1; C 0,1.1; E 0.95,-1.1
TV16 = drill 1 pad 1.93: IA -5.08,-6.35; IB -5.08,6.35; OA 5.08,6.35; OB 5.08,-6.35
SOIC8_150MIL = smd 0.6 x 2.2: 1 -1.905,-2.6; 2 -0.635,-2.6; 3 0.635,-2.6; 4 1.905,-2.6; 5 1.905,2.6; 6 0.635,2.6; 7 -0.635,2.6; 8 -1.905,2.6
RHT03_DHT-22 = drill 0.8: DATA -1.27,0; GND 3.81,0; NULL 1.27,0 | drill 0.8 octagon: VDD -3.81,0
ARDUINO_PRO_MINI = drill 1.016 pad 1.88: 1 -7.62,12.7; 2 -7.62,10.16; 3 -7.62,7.62; 4 -7.62,5.08; 5 -7.62,2.54; 6 -7.62,0; 7 -7.62,-2.54; 8 -7.62,-5.08; 9 -7.62,-7.62; 10 -7.62,-10.16; 11 -7.62,-12.7; 12 -7.62,-15.24; 13 7.62,-15.24; 14 7.62,-12.7; 15 7.62,-10.16; 16 7.62,-7.62; 17 7.62,-5.08; 18 7.62,-2.54; 19 7.62,0; 20 7.62,2.54; 21 7.62,5.08; 22 7.62,7.62; 23 7.62,10.16; 24 7.62,12.7; 25 -1.27,-15.24; 26 -3.81,-15.24; 27 3.81,-15.24; 28 1.27,-15.24
SO08' = smd 0.61 x 2.21: 1 -1.905,-2.616; 2 -0.635,-2.616; 3 0.635,-2.616; 4 1.905,-2.616; 5 1.905,2.616; 6 0.635,2.616; 7 -0.635,2.616; 8 -1.905,2.616
DCDCMODULE = drill 1.6 square: GND#0 1.7,1.7; GND#1 41.9,1.7 | drill 1.6 octagon: VIN 1.7,19.5 | drill 1.6: VOUT 41.9,19.5
SO16 = smd 0.66 x 2.032: 1 -4.445,-3.073; 2 -3.175,-3.073; 3 -1.905,-3.073; 4 -0.635,-3.073; 5 0.635,-3.073; 6 1.905,-3.073; 7 3.175,-3.073; 8 4.445,-3.073; 9 4.445,3.073; 10 3.175,3.073; 11 1.905,3.073; 12 0.635,3.073; 13 -0.635,3.073; 14 -1.905,3.073; 15 -3.175,3.073; 16 -4.445,3.073

### Placement (x,y rotation side)
ADJ_VPWRSPLY  30.25,9 270 top
B1  66.25,138 315 top
BAT1  88,52.75 90 top
C1  104,44.75 0 top
C2  74.25,144.5 270 top
C3  39.5,126 90 top
C4  46.5,126 90 top
C5  45.25,117 0 top
C6  43.5,109.75 0 top
D1  41.5,9.75 90 top
D2  116.5,31 90 top
D3  84.75,146.25 0 top
F1  72.5,115 180 top
F2  55.5,115 180 top
F3  64,115 180 top
FAN_A  122.5,29 270 top
FROM_GREY_REG  76,18 0 top
FROM_LTC_REG_A  111,18 0 top
FROM_LTC_REG_B  121,18 0 top
IC3  103.25,34.25 270 top
INDICATOR_CONN  121.25,132.25 90 top
J2  48.5,121 0 top
J3  75.25,127 0 top
J4  36.5,110.5 0 top
J5  26,106.25 0 top
J6  18,96.25 0 top
J7  50,100.25 0 top
J8  25,89 0 top
J9  61.25,100.25 0 top
OUT_+6V5  9,38 90 top
OUT_+12V  9,48 90 top
OUT_+13V5  9,58 90 top
OUT_+19V5  9,68 90 top
OUT_+24V  9,78 90 top
OUT_+48V_A  9,98 90 top
OUT_+48V_B  9,88 90 top
PCB1  125,40 90 top
Q1  104.5,53 0 top
Q2  114,30.75 270 top
R1  108.25,131.25 90 bottom
R2  14.75,67 0 top
R3  14.75,69 180 top
R4  14.75,77 0 top
R5  96.5,34.75 0 top
R6  96.5,37.25 180 top
R7  34,117 180 bottom
R8  34,119 0 bottom
R10  14.75,102 0 top
R11  14.75,104 180 top
R12  14.75,87 0 top
R13  14.75,89 180 top
R14  14.75,37 0 top
R15  14.75,39 180 top
R16  14.75,47 0 top
R17  14.75,49 180 top
R20  49.25,15 180 top
R21  49.25,13 0 top
R22  38,8.25 90 top
R24  126.25,129.75 0 bottom
R25  116.25,129.75 180 bottom
R26  126.25,132.25 0 bottom
R27  116.25,132.25 180 bottom
R28  14.75,57 0 top
R29  14.75,59 180 top
R30  81.5,137.25 270 top
R31  81.5,133.25 270 top
R32  42.25,136.75 270 bottom
R33  57.5,138 90 bottom
R34  14.75,79 180 top
R53  14.25,27.25 270 top
R54  96.5,32.25 0 top
R55  103.5,29.5 180 top
R57  109,34.25 90 top
RPI_RESET  9,25 270 top
SJ1  80.25,98 270 top
SJ2  70.25,78.5 270 top
SJ3  61,130.5 90 top
SJ4  70.25,34.5 270 top
SJ5  70.25,56.5 270 top
SJ6  80.5,142.75 180 top
T1  44.75,14 90 top
TO_GREY_REG  86,18 0 top
TO_LTC_REG  101,18 0 top
TV16  50,138 0 top
U1  104.5,48.75 270 top
U3  106,132.5 90 top
U$1  92,123.25 0 top
U$2  ACS712  [SO08']  43,123.75 0 top
U$3  35,82 0 top
U$4  ACS712  [SO08']  43,113.5 270 top
U$5  25,16 0 top
U$6  25,60 0 top
U$8  93,93 0 top
U$10  25,38 0 top
VAC  28,142 270 top
VBAT  28,118 270 top
VPWRSPLY  28,130 270 top

### Tracks (layer width: path | path; a pad name or v marks a point on that pad's centre or on a via)
+3V3  (via drill 0.6)
  Top 0.813: SJ2.2 70.25,76.75
  Top 1.27: v95.5,76.75 70.25,76.75 49.75,76.75 39.25,66.25 26.5,66.25 21.5,61.25 21.5,50 31,40.5 31,34 29.5,32.5 20.75,32.5 16.35,28.1 R53.1
  Bottom 0.813: R27.1 R25.1 115.4,127.85 115.5,127.75 | INDICATOR_CONN.5 126.21,134.79 127.1,133.9 R26.1 R24.1 127.1,128.6 126.25,127.75 115.5,127.75 | 115.5,127.75 110.75,127.75 103.75,120.75 103.75,106.75 102.25,105.25 93,105.25 88.75,101 88.75,83.5 v95.5,76.75
+5V  (via drill 0.6)
  Top 0.61: C5.2 46.25,116.04 U$4.8 | U$2.8 40.46,127 C3.2 | C1.2 104.85,49.85 105.66,50.66 U1.8 | U$8.16 88.56,96.06 88.5,96
  Top 0.813: v80.25,96 SJ1.2 v80.25,97 | v80.25,96 v80.25,95 | 88.5,96 v80.25,96 | v37.75,125 37.75,126.25 38.5,127 C3.2
  Top 1.27: PCB1.4 PCB1.2 120.66,42.12 119.12,42.12 116.5,44.75 C1.2 104.85,43.1 103.5,41.75 76.5,41.75 75.25,40.5 75.25,28 72,24.75 56.25,24.75 54.25,22.75 54.25,14.25 53,13 R21.2 | U$1.21 101.67,128.33 108,122 | v82,80.5 v82,78.5
  Top 2.54: v81,79.5 93.5,79.5 108,94 108,122
  Bottom 0.813: R1.1 106.54,128.69 U3.VDD 105.64,128.33 U$1.21 | v81,79.5 v82,79.5 v83,79.5 | v82,78.5 82,78.75 82.25,79
  Bottom 1.27: C5.2 46.25,116 45,114.75 | 45,114.75 39,114.75 37.75,116 v37.75,125 | 81.25,95 82.75,96.5 82.75,100.25 77.75,105.25 77.75,119.5 75.5,121.75 55.5,121.75 54.5,120.75 54.5,118.75 48,112.25 46.25,112.25 45,113.5 45,114.75
  Bottom 2.54: PCB1.2 120.74,42 119.25,42 110.5,50.75 110.5,53 104.5,59 102.25,59 82.25,79 82,79.25 v82,79.5 82,94.25 81.25,95 v80.25,96
  other vias: 46.25,117
+6V5  (via drill 0.6)
  Top 0.61: SJ4.2 70.25,32.75
  Top 0.813: v24,25.75 v23,25.75 v23,26.75 v23,27.75 v24,27.75 v25,27.75 v25,26.75 | v24,25.75 v25,25.75 | v24,25.75 v24,26.75
  Top 1.27: 70.25,32.75 70.25,30.75 69,30.75 | OUT_+6V5.1 12.38,35.48 R14.1 | v46.25,5.75 v46.25,4.75 v45.25,4.75 v44.25,4.75 v44.25,5.75 v44.25,6.75 v45.25,6.75 v46.25,6.75
  Top 2.54: FROM_LTC_REG_B.2 123.49,7.74 121.5,5.75 v46.25,5.75 v45.25,5.75
  Top 3.81: v24,26.75 v25,26.75 45.5,26.75 49.5,30.75 69,30.75
  Bottom 1.27: v44.25,4.75 v44.25,6.75 v46.25,6.75 v46.25,4.75
  Bottom 2.54: v25,25.75 34.5,16.25 34.5,4.25 37,1.75 43.25,1.75 45,3.5 v45.25,5.75
  Bottom 3.81: OUT_+6V5.1 15.27,35.48 v24,26.75
+12V
  Top 0.61: R54.1 R5.1 94.5,34.75 94,35.25 94,39 94.75,39.75 102.75,39.75 103.75,38.75 103.75,35.75 104.61,34.88 IC3.7
  Top 1.27: OUT_+12V.1 12.38,45.48 R16.1 | R54.1 95.65,30.35 99.5,26.5 106,26.5 106.5,26 116.42,26 D2.C
  Bottom 1.27: FAN_A.1 117.78,27.2 D2.C 118.48,23.93 FROM_LTC_REG_B.1
  Bottom 2.54: FROM_LTC_REG_B.1 118.48,6.99 114,2.5 54.75,2.5 47.5,9.75 40.75,9.75 38.25,12.25 38.25,17.75 31,25 31,35.5
  Bottom 3.81: U$5.VIN 31,35.5 31,44.25 27.25,48 17.5,48 15,45.5 9.02,45.5 OUT_+12V.1
+13V5  (via drill 0.6)
  Top 0.61: SJ5.2 70.25,55
  Top 0.813: v24.25,51.75 v24.25,52.75 v24.25,53.75 v25.25,53.75 | v25.25,53.75 v26.25,53.75 v26.25,52.75 v26.25,51.75 v25.25,51.75 v25.25,52.75 v25.25,53.75
  Top 1.27: R28.1 12.38,55.48 OUT_+13V5.1 | 70.25,55 70.25,52.5 69,52.75
  Top 3.81: v26.25,52.75 69,52.75
  Bottom 2.54: FROM_LTC_REG_A.2 113.49,10.49 108.75,5.75 56.75,5.75 35.25,27.25 35.25,46 28.5,52.75 v25.25,52.75
  Bottom 3.81: OUT_+13V5.1 19.52,55.48 22.25,52.75 v25.25,52.75
+19V5
  Top 1.27: OUT_+19V5.1 12.38,65.48 R2.1
  Bottom 2.54: FROM_LTC_REG_A.1 108.48,10.98 106.5,9 58.75,9 38.75,29 38.75,47.5 31,55.25 31,57.5
  Bottom 3.81: 9.02,65.5 OUT_+19V5.1 9.52,66 29,66 31,64 31,57.5 U$10.VIN
+24V
  Top 1.27: OUT_+24V.1 12.38,75.48 R4.1
  Top 3.81: U$6.VIN 26.7,80.95 36.75,91 36.75,101.45 U$3.VIN
  Bottom 3.81: 73.25,13 76.5,13 | 76.5,13 96.5,13 98.5,15 98.5,17.98 TO_LTC_REG.1 | 76.48,13.02 76.5,13 | OUT_+24V.1 9.02,75.5 22.75,75.5 26.7,79.45 U$6.VIN 36,70.2 36,57.5 43.25,50.25 43.25,30.75 61,13 73.25,13 | FROM_GREY_REG.1 73.48,13.23 73.25,13
+48V_A
  Top 1.27: R10.1 13.9,100.39 OUT_+48V_A.1
  Bottom 3.81: OUT_+48V_A.1 9.75,96.25 13,96.25 | F2.1 53.77,109.77 53.75,109.75
  Bottom 6.452: 13,96.25 J6.P$1 46,96.25 J7.P$1 52,102.25 52.75,103 53.75,104 53.75,109.75
+48V_B
  Top 1.27: OUT_+48V_B.1 12.38,85.48 R12.1
  Bottom 1.676: 62.27,100.52 61.52,100.52 J9.P$1
  Bottom 3.81: F3.1 62.27,109.77 | OUT_+48V_B.1 10.73,85.48 14.25,89 15,89
  Bottom 6.452: 15,89 J8.P$1 50.75,89 62.27,100.52 62.27,109.77
ADJ_VOLTAGE
  Top 1.27: ADJ_VPWRSPLY.2 31.84,8.1 31.85,8.1 32.85,9.1 R22.2
AGND  (via drill 0.6)
  Top 0.61: 44,116.75 C5.1 43.5,116.25 43.5,111.75 43.66,111.59 | C3.1 39.75,125 40.5,124.25 45,124.25 | 45,124.25 45.75,124.25 C4.1 | U$2.5 44.91,124.34 45,124.25 | U$4.5 43.66,111.59 | 43.66,111.59 43.34,111.59 42.5,110.75 C6.1
  Top 0.813: C4.1 47.5,125 51.75,129.25 57.75,129.25 59.75,131.25 60.99,131.25 SJ3.2
  Top 1.016: 81.75,142.75 SJ6.1 81.25,142.74 81.25,141.5 78.5,138.75 74.5,138.75 67,131.25 61.01,131.25 SJ3.2
  Top 1.778: 81.75,142.75 86.33,142.75 D3.A
  Bottom 1.27: C5.1 44.25,122.75 C4.1
  other vias: 46.5,125 44.25,117
ARDU_RX
  Bottom 0.813: U$1.2 84.29,133.5 78.25,133.5 77,132.25 77,130.75 80,127.75 80,106 84.75,101.25 84.75,82.5 117.61,49.64 PCB1.8
ARDU_TX  (via drill 0.6)
  Top 0.813: v79,131.5 79,135.5 80,136.5 81.4,136.5 R30.2 | 81.4,134 R31.1
  Top 1.016: R30.2 R31.1
  Bottom 0.813: PCB1.10 117.57,52.18 86.75,83 86.75,102 82,106.75 82,128.5 v79,131.5
CTRL_CHARGING
  Top 1.27: PCB1.12 118.53,54.72 105.75,67.5 76.5,67.5 75.25,66.25 75.25,43.75 73,41.5 73,29 71,27 54.5,27 50.1,22.6 R20.1
DHT_DATA
  Bottom 0.813: 105.98,131.25 U3.DATA 106.87,132.1 R1.2 109.4,132.1 110.25,131.25 110.25,129.5 102,121.25 102,108.75 101.25,108 101.24,108.01 U$1.13
GND  (via drill 0.6)
  Top 0.61: R55.1 104.77,30.48 102.91,32.34 102.75,32.34 | IC3.4 102.75,32.34 | R6.2 95.65,38.15 96.25,38.75 102.25,38.75 102.75,38.25 102.75,32.34 | U1.4 101.9,44.7 102,44.6 | T1.E 45.85,15.4 45.75,15.5 | U$8.6 95.18,89.93 95.25,90 | 97,90 96.25,90 U$8.7 U$8.8
  Top 0.813: U$8.6 94.91,87.16 89.75,82 78,82 76.9,83.1 U$3.GND#1
  Top 1.016: U$1.4 83.92,128.33 81.5,130.75 R31.2 | U$1.4 88.83,128.33 93.91,133.41 U$1.23 | SJ3.1 67.74,129.74 70,132 75.75,132 79.5,128.25 84.3,128.25 U$1.4 | 102,44.6 BAT1.2
  Top 1.27: OUT_+48V_B.2 12.38,90.52 R13.2 | OUT_+24V.2 12.38,80.52 R34.2 | OUT_+19V5.2 12.38,70.52 R3.2 | OUT_+13V5.2 12.38,60.52 R29.2 | OUT_+12V.2 12.38,50.52 R17.2 | 30.27,11.5 ADJ_VPWRSPLY.1 | 102,44.6 103,44.6 C1.1 | OUT_+48V_A.2 9.02,100.52 12.5,104 R11.2 | OUT_+6V5.2 12.38,40.52 R15.2 | 45.75,15.5 43.5,17.75 26.75,17.75 U$5.GND#0 | 126.25,22.75 127,22.75 | 95.25,90 97,90
  Top 1.778: PCB1.9 125.57,52.18 127,50.75 127,22.75 127,3.5 125.25,1.75 27.5,1.75 25.75,3.5 25.75,9.25 28,11.5 30.23,11.5 ADJ_VPWRSPLY.1 | INDICATOR_CONN.6 117.04,134.79 113,130.75 v113,93.25
  Top 2.54: U$6.GND#1 U$6.GND#0 | TO_LTC_REG.2 103.49,20.99 105.25,22.75 126.25,22.75
  Top 3.81: U$5.GND#1 66.9,14.85 68.75,13 78.5,13 | 78.5,13 83.5,13 | 83.5,13 101.5,13 103.5,15 TO_LTC_REG.2 | FROM_GREY_REG.2 78.49,13.01 78.5,13 | TO_GREY_REG.1 83.48,13.02 83.5,13
  Bottom 0.61: R8.2 29.52,119 VBAT.1
  Bottom 0.813: U$1.23 103.1,133.41 U3.GND 106.19,136.31 107.75,134.75 119.94,134.75 INDICATOR_CONN.6 | v113,93.25 113,93.75 v113,94.25
  Bottom 1.27: Q2.C 106.02,30.75 R55.1 104.77,22.27 103.49,20.99 TO_LTC_REG.2
  Bottom 1.676: 127.25,72.5 127.25,88.75 123.5,92.5 123.25,92.5 123.3,92.45 PCB1.39 | 127.25,72.5 127.25,53.75 125.68,52.18 | PCB1.25 127.25,72.5
  Bottom 1.778: PCB1.9 125.68,52.18 | 123.25,92.5 114.25,92.5 113,93.75 | v113,94.25 v113,95.25
  Bottom 2.54: 23,120.5 23,130 25.5,132.5 27.98,132.5 VPWRSPLY.1 | 23,120.5 23,110.25 19.75,107 5.5,107 3,104.5 3,100.5 | 3,100.5 3,90.5 | 3,90.5 3,80.25 | 3,80.25 3,70.5 | 3,70.5 3,60.5 | 3,60.5 3,50.5 | VBAT.1 23.02,120.52 23,120.5 | OUT_+48V_A.2 3.02,100.52 3,100.5 | OUT_+48V_B.2 3.02,90.52 3,90.5 | 3,80.25 3.27,80.52 OUT_+24V.2 9.02,80.5 20.25,80.5 23.5,83.75 26.75,83.75 26.8,83.7 U$3.GND#0 | OUT_+19V5.2 3.02,70.52 3,70.5 | 3,60.5 3.02,60.52 OUT_+13V5.2 9.02,60.5 23.25,60.5 24.45,61.7 U$6.GND#0 | OUT_+12V.2 3.02,50.52 3,50.5 | 26.7,39.8 U$10.GND#0 26.75,39.75 26.75,42 24.75,44 19.5,44 16,40.5 9.02,40.5 OUT_+6V5.2 8.98,40.5 3,40.5 | 3,50.5 3,40.5 | 3,40.5 3,28.25 | RPI_RESET.3 3,28.25 | 3,28.25 3,21.5 | 3,21.5 3,20.25 5.55,17.7 U$5.GND#0 26.75,17.75 27.75,17.75 30.25,15.25 ADJ_VPWRSPLY.1 | RPI_RESET.4 3.25,21.75 3,21.5 | U$3.GND#1 77,83.6 77,80 66.9,69.9 U$6.GND#1 66.95,61.75 69.5,61.75 73,58.25 73,45.75 71.85,44.6 | 71.8,44.6 U$10.GND#1 66.95,39.7 71.25,44 71.85,44.6 | BAT1.2 71.85,44.6
  pour Bottom (isolate 1.016): 50.5,150 50.5,129 40.5,129 33.75,135.75 20,135.75 20,110 0,110 -0.25,14.5 20,14.5 20,0 130,0 130,150
INDC_HEALTH_BLUE
  Top 1.676: INDICATOR_CONN.3 123.75,132.25 128.25,127.75 128.25,88 125.5,85.25 123.35,85.25 PCB1.35
  Bottom 0.813: INDICATOR_CONN.3 R26.2
INDC_HEALTH_GREEN
  Top 1.676: INDICATOR_CONN.2 119.96,129.71 118.5,128.25 118.5,89.25 120,87.75 PCB1.38
  Bottom 0.813: R25.2 119.94,129.75 INDICATOR_CONN.2
INDC_HEALTH_RED
  Top 1.676: INDICATOR_CONN.1 122.54,129.71 125.5,126.75 125.5,89.25 124,87.75 123.75,87.75 123.74,87.74 PCB1.37
  Bottom 0.813: INDICATOR_CONN.1 125.36,129.71 R24.2
INDC_SPLY_OUTS
  Top 1.676: INDICATOR_CONN.4 118.5,132.25 115.75,129.5 115.75,88 118.5,85.25 120.71,85.25 PCB1.36
  Bottom 0.813: R27.2 INDICATOR_CONN.4
N$1
  Bottom 2.54: VAC.2 39.93,139.51 R32.1
N$2
  Bottom 2.54: VAC.1 28.02,144.51 31,147.5 41.77,147.5 TV16.IB
N$3
  Top 0.61: U1.1 103.91,50.66 105.75,52.5 105.75,52.98 Q1.2
N$4
  Top 0.61: U1.2 100.61,49.38 100,50 100,52.5 100.5,53 Q1.1
N$5
  Top 0.61: U1.3 99.39,48.12 98.75,48.75
  Top 1.27: 98.75,48.75 88,59.5 BAT1.1
N$6
  Top 0.813: U$8.15 89.83,94.42 90.5,93.75 91.75,93.75 92.36,94.36 U$8.13
N$7
  Top 0.813: U$8.4 92.36,92.36 93.64,93.64 U$8.12
N$8
  Top 1.27: U$3.VOUT 77.77,101.5 SJ1.1
N$9
  Top 1.27: U$6.VOUT 67,79.5 67.25,79.75 70.02,79.75 SJ2.1
N$10
  Top 0.61: U$2.6 43.63,127.89 44,128.25 46.25,128.25 46.5,128 C4.2
N$13
  Top 1.27: U$5.VOUT 70.23,35.5 SJ4.1
N$14
  cutout Bottom: 20,150 49.75,150 49.75,129.75 41,129.75 34.25,136.5 20,136.5
N$15
  Top 0.61: IC3.3 98.61,33.62 97.35,32.35 R54.2 97.35,32.15 98.5,31 100.73,31 R55.2
N$16
  Top 0.61: U$4.6 47.13,112.86 47.5,112.5 47.5,111 46.25,109.75 C6.2
N$17
  Bottom 10: 86.25,26.75 61.75,26.75 54.75,33.75 54.75,35.25
  Bottom 12: 54.75,35.25 54.75,77.25
  Bottom 3.81: F1.1 70.77,109.77 | TO_GREY_REG.2 88.49,26.49 88.75,26.75 86.25,26.75
  Bottom 6.452: 70.77,109.77 70.77,96.52 54.75,80.5 54.75,77.25
N$18
  Top 0.61: R6.1 R5.2 97.48,34.88 IC3.2
N$19
  Top 1.27: R21.1 48.4,11.9 47.75,11.25 44.25,11.25 43.65,11.85 T1.C 42.82,14.83 D1.A
N$20
  Bottom 1.27: FAN_A.2 121.88,30.7 120.01,32.57 119.54,33.04 | 119.54,33.04 D2.A | Q2.E 119.54,33.04
N$21
  Bottom 1.778: B1.AC1 66.25,138 61.17,143.08 R33.2
  Bottom 2.54: TV16.OA 56.23,144.35 R33.2
N$22
  Top 0.61: T1.B 46.05,13.05 48,15 R20.2
N$23
  Top 1.27: SJ5.1 66.92,57.52 U$10.VOUT
N$24
  Top 1.27: R22.1 38.77,7.4 D1.C
N$26
  Top 1.016: SJ6.2 79.25,142.75
  Top 1.778: 79.25,142.75 74.28,142.75 C2.-
  Bottom 1.778: B1.- 70.16,134.41 74.25,138.5 C2.-
N$35
  Top 1.016: R30.1 82.9,138.1 84.38,136.62 U$1.1
N$36
  Bottom 2.54: R32.2 44.9,131.67 TV16.IA
N$38
  Bottom 1.778: R33.1 57.58,132.92 B1.AC2
  Bottom 2.54: TV16.OB 56.23,131.65 R33.1
N$39
  Top 0.61: IC3.6 106.86,33.62 108.35,35.1 R57.2
N$40
  Top 1.27: R57.1 109,30 110.5,28.5 112.69,28.5 Q2.B
RPI_RESET
  Top 1.27: RPI_RESET.1 13.11,26.4 R53.2 18.4,26.4 22.25,30.25 42,30.25 43,31.25 43.38,31.62 47.25,35.5 57,35.5 73,51.5 73,71.5 75,73.5 99.75,73.5 106.37,80.12 PCB1.32
  Bottom 2.54: RPI_RESET.2 RPI_RESET.1
RTC_SCL
  Top 0.406: 122,48.38 119.31,48.38
  Top 0.813: PCB1.5 123.28,47.1 122,48.38 | U1.6 119.05,48.12 119.31,48.38
RTC_SDA
  Top 0.406: 122.06,45.81 119.31,45.81
  Top 0.813: PCB1.3 123.3,44.58 122.06,45.81 | 119.31,45.81 118.28,46.84 U1.5
SEL_SENSOR_1
  Top 0.813: U$8.11 94.91,99.91 102,107 102,108.75 100.2,110.55 U$1.14
SEL_SENSOR_2
  Top 0.813: U$1.15 100.16,113.09 103.5,109.75 103.5,106.5 96.17,99.17 U$8.10
SEL_SENSOR_3
  Top 0.813: U$1.16 100.12,115.63 105,110.75 105,106 97.44,98.44 U$8.9
SENSOR_+6V5
  Top 0.61: U$8.5 93.64,88.14 89.5,84 81.75,84
  Top 1.27: 81.75,84 79.25,86.5 56.5,86.5 38.25,68.25 25.75,68.25 19.5,62 19.5,47.75 15.6,43.85 R15.1 R14.2
SENSOR_+12V
  Top 0.61: U$8.3 91.09,87.84 89.25,86 82.75,86
  Top 1.27: R16.2 R17.1 15.6,49.1 17.5,51 17.5,62.75 25,70.25 37.25,70.25 55.5,88.5 80.25,88.5 82.75,86
SENSOR_+13V5
  Top 0.61: U$8.2 89.83,88.58 89.25,88 83.75,88
  Top 1.27: R28.2 R29.1 15.6,63.6 24.25,72.25 36.25,72.25 54.5,90.5 81.25,90.5 83.75,88
SENSOR_+19V5
  Top 0.61: U$8.1 84.82,89.93 84.75,90
  Top 1.27: R2.2 R3.1 15.6,69.1 20.75,74.25 35.25,74.25 53.5,92.5 82.25,92.5 84.75,90
SENSOR_+24V
  Top 1.27: R34.1 R4.2 15.6,76.9 16.25,76.25 34.25,76.25 52.5,94.5 66,94.5 75.75,104.25 78.25,104.25 81.5,101 89.25,101 93.25,105 93.25,107.99 U$1.28
SENSOR_+48V_A
  Top 0.813: R10.2 28.5,102 33,106.5 58.25,106.5
  Top 1.27: U$1.26 88.19,106.19 87,105 83.75,105 80.5,108.25 60,108.25 58.25,106.5 | R11.1 R10.2
SENSOR_+48V_B
  Top 0.813: 15.6,89.1 18.6,89.1 34.25,104.75 59.5,104.75
  Top 1.27: R12.2 R13.1 15.6,89.1 | U$1.25 90.75,107.99 90.75,105.5 88.25,103 82.75,103 79.5,106.25 61,106.25 59.75,105 59.5,104.75
SENSOR_IBAT  (via drill 0.6)
  Top 0.61: U$4.7 46.74,114.14 v46.75,114.12
  Bottom 0.813: v46.75,114.12 46.88,114.12 52.5,119.75 52.5,121.5 56.25,125.25 68,125.25 82.5,139.75 88,139.75 90,137.75 90,119 90.83,118.17 U$1.17
SENSOR_ILOAD  (via drill 0.6)
  Top 0.61: U$2.7 42.37,128.24 v42.38,128.25
  Bottom 0.813: v42.38,128.25 67,128.25 81.5,142.75 89.5,142.75 93,139.25 93,124.25 94,123.25 U$1.19
SENSOR_SPLY
  Top 0.813: U$8.14 91.09,99.59 95.75,104.25 95.75,107.95 U$1.27
SENSOR_VAC
  Bottom 0.813: D3.C 79.67,146.42 81.5,148.25 90.75,148.25 91.75,147.25 91.75,142.75 94.5,140 94.5,126.75 95.46,125.79 U$1.20
  Bottom 1.778: B1.+ 66.25,141.75 70.75,146.25 74.22,146.25 C2.+ 79.64,146.28 D3.C
SENSOR_VBAT
  Bottom 0.61: R7.2 R8.1
  Bottom 0.813: R8.1 34.85,124.35 37.25,126.75 67.5,126.75 82,141.25 88.75,141.25 91.5,138.5 91.5,121.75 92.54,120.71 U$1.18
VBAT
  Top 0.61: U$4.3 40.38,112.25 U$4.4
  Top 1.778: 40.38,112.25 39.25,111.25
  Top 3.81: 39.25,111.25 36.25,111.25 | 36.25,111.25 32,115.5 VBAT.2 | VBAT.2 | 36.25,111.25 36.25,110.75 J4.P$1 | VBAT.2 28.01,108.26 J5.P$1
  Bottom 0.61: R7.1 29.49,117 VBAT.2
  pour Top (isolate 1.016): 20,117.75 20,103.5 43,103.5 43,113.5 38.25,113.5 34,117.75 33.75,118 20,118
VLOAD
  Top 0.61: U$2.3 U$2.4
  Top 1.27: 45.16,121.13 48.37,121.13 J2.P$1
  Top 2.54: U$2.4 45.16,121.13
  Top 3.81: F1.2 74.23,121 | 74.23,121 74.23,125.98 J3.P$1 | 45.16,121.13 57.25,121.13 | 57.25,121.13 65.75,121.13 | 65.75,121.13 74.1,121.13 74.23,121 | F2.2 57.23,121.11 57.25,121.13 | F3.2 65.73,121.11 65.75,121.13
  pour Top (isolate 1.016): 51.75,127.5 51.75,115 76.25,115 76.25,127.5
VPWRSPLY
  Top 0.61: U$4.1 40.38,114.75 U$4.2 | U$2.2 U$2.1
  Top 1.778: 40.38,114.75 40,114.75 | U$4.1 40.38,115.62 40.25,115.75
  Top 2.54: U$2.1 40.62,121.13
  Top 3.81: 40.62,121.13 40.5,121.13 | 40.5,121.13 37.37,121.13 31,127.5 VPWRSPLY.2 | 40.25,115.75 40.25,120.88 40.5,121.13
  pour Top (isolate 1.016): 20,130 20,123.25 31,123.25 40.75,114.25 43,114.25 43,123.75 39.75,123.75 33.5,130

### Text on the board
tNames: J3 | J2 | J4 | J5 | J7 | J9 | J6 | J8